# Altium project master-010106.PrjPcb (part 3 of 5)

## Sheet power.SchDoc
size A4; DocumentNumber: 5; SheetNumber: 5; SheetTotal: 24; SheetDescription: Decoupling and references for MCU0; ClassName: ISO_MCU
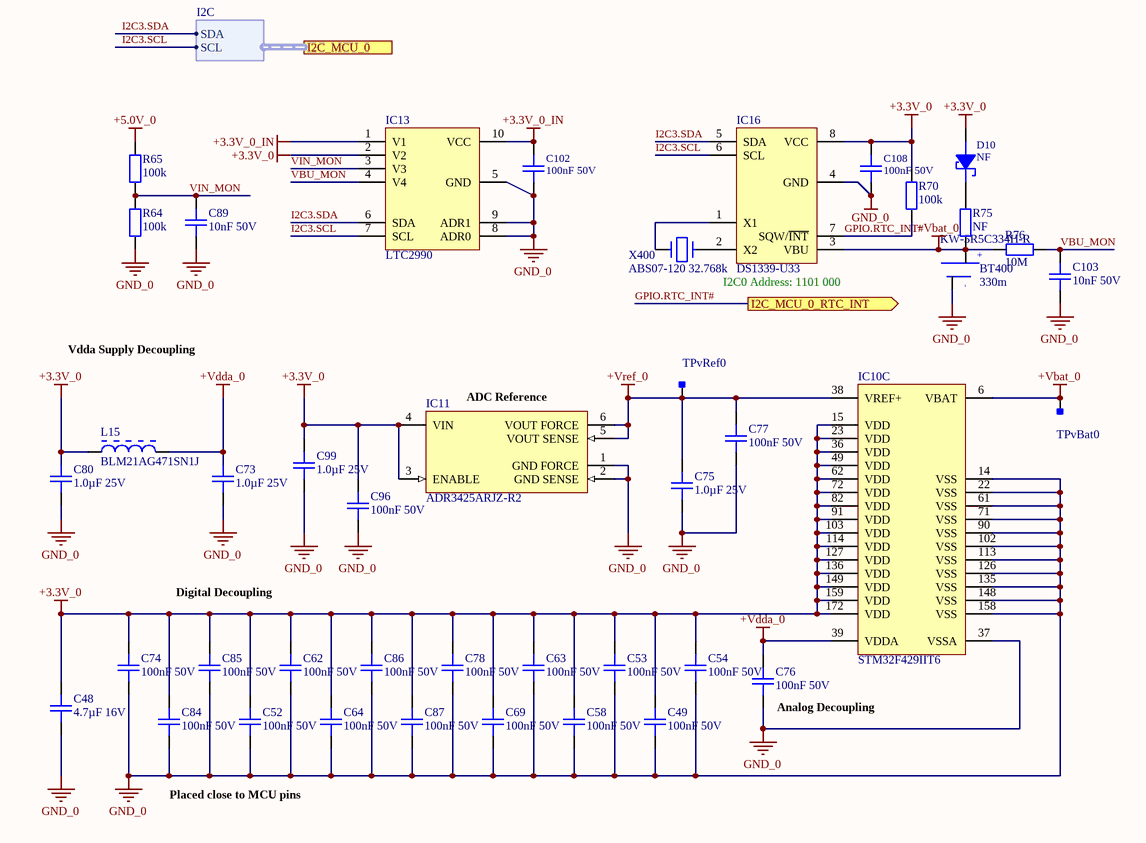
[diagram p12: power.SchDoc]

### Parts
(Parts that share a designator on the sheet are numbered #1, #2 ... from top to bottom, then left to right.)
BT400  330m  Supplier Part Number 1: KW-5R5C334H-R  [KW-5R5C]
C48  4.7µF 16V  [0805C]
C49  100nF 50V  [0402C]
C52  100nF 50V  [0402C]
C53  100nF 50V  [0402C]
C54  100nF 50V  [0402C]
C58  100nF 50V  [0402C]
C62  100nF 50V  [0402C]
C63  100nF 50V  [0402C]
C64#2  100nF 50V  [0402C]
C69  100nF 50V  [0402C]
C73  1.0µF 25V  [0603C]
C74#2  100nF 50V  [0402C]
C75  1.0µF 25V  [0603C]
C76  100nF 50V  [0402C]
C77  100nF 50V  [0402C]
C78#1  100nF 50V  [0402C]
C80  1.0µF 25V  [0603C]
C84#1  100nF 50V  [0402C]
C85  100nF 50V  [0402C]
C86  100nF 50V  [0402C]
C87  100nF 50V  [0402C]
C89  10nF 50V  [0603C]
C96  100nF 50V  [0603C]
C99#2  1.0µF 25V  [0603C]
C102#2  100nF 50V  [0603C]
C103  10nF 50V  [0603C]
C108  100nF 50V  [0603C]
D10  NF  [NF_SOD-523]
IC10  STM32F429IIT6  [STM-LQFP176_N]  (part C of 3)
IC11  ADR3425ARJZ-R2  [ADI-RJ-6_N]
IC13  LTC2990  [MSOP-10]
IC16  DS1339-U33  [USOP-8]
L15  BLM21AG471SN1J  [MURA-BLM21-H1-CHIP-2_V]
R64#2  100k  [0603R]
R65#2  100k  [0603R]
R70  100k  [0603R]
R75  NF  [0603R]
R76  10M  [0603R]
TPvBat0  Testpoint_Square  [Testpoint_S1]  (value not drawn)  (no BOM)
TPvRef0  Testpoint_Square  [Testpoint_S1]  (value not drawn)  (no BOM)
X400  ABS07-120 32.768k  [ABS07]

### Ports
I2C_MCU_0 (harness I2C), I2C_MCU_0_RTC_INT (out)

### Harnesses
I2C: SDA, SCL

### Nets
+3.3V_0: C48.1 C49.1 C52.1 C53.1 C54.1 C58.1 C62.1 C63.1 C64#2.1 C69.1 C74#2.1 C78#1.1 C80.1 C84#1.1 C85.1 C86.1 C87.1 C96.1 C99#2.1 C108.1 D10.1(A) IC10.15(VDD) IC10.23(VDD) IC10.36(VDD) IC10.49(VDD) IC10.62(VDD) IC10.72(VDD) IC10.82(VDD) IC10.91(VDD) IC10.103(VDD) IC10.114(VDD) IC10.127(VDD) IC10.136(VDD) IC10.149(VDD) IC10.159(VDD) IC10.172(VDD) IC11.3(ENABLE) IC11.4(VIN) IC13.2(V2) IC16.8(VCC) L15.1 R70.2
+3.3V_0_IN: C102#2.1 IC13.1(V1) IC13.10(VCC)
+5.0V_0: R65#2.2
+Vbat_0: BT400.1(pos1) IC10.6(VBAT) IC16.3(VBU) R75.2 R76.2 TPvBat0.1
+Vdda_0: C73.1 C76.1 IC10.39(VDDA) L15.2
+Vref_0: C75.1 C77.1 IC10.38(VREF+) IC11.5(VOUT_SENSE) IC11.6(VOUT_FORCE) TPvRef0.1
GND_0: BT400.2(neg) C48.2 C49.2 C52.2 C53.2 C54.2 C58.2 C62.2 C63.2 C64#2.2 C69.2 C73.2 C74#2.2 C75.2 C76.2 C77.2 C78#1.2 C80.2 C84#1.2 C85.2 C86.2 C87.2 C89.1 C96.2 C99#2.2 C102#2.2 C103.1 C108.2 IC10.14(VSS) IC10.22(VSS) IC10.37(VSSA) IC10.61(VSS) IC10.71(VSS) IC10.90(VSS) IC10.102(VSS) IC10.113(VSS) IC10.126(VSS) IC10.135(VSS) IC10.148(VSS) IC10.158(VSS) IC11.1(GND_FORCE) IC11.2(GND_SENSE) IC13.5(GND) IC13.8(ADR0) IC13.9(ADR1) IC16.4(GND) R64#2.1  [project net GND]
GPIO.RTC_INT#: IC16.7(SQW/~{INT}) R70.1 ; port I2C_MCU_0_RTC_INT
I2C3.SCL: IC13.7(SCL) IC16.6(SCL) ; port I2C_MCU_0.SCL
I2C3.SDA: IC13.6(SDA) IC16.5(SDA) ; port I2C_MCU_0.SDA
VBU_MON: C103.2 IC13.4(V4) R76.1
VIN_MON: C89.2 IC13.3(V3) R64#2.2 R65#2.1
NetD10_2: D10.2(C) R75.1
NetIC16_1: IC16.1(X1) X400.2
NetIC16_2: IC16.2(X2) X400.1

### Notes on the sheet
- I2C0 Address: 1101 000
- Vdda Supply Decoupling
- (near IC11) ADC Reference
- Digital Decoupling
- (near C76) Analog Decoupling
- Placed close to MCU pins
- Title
- Size:
- Date:
- Tabloid
- Number:
- Time:
- Revision:
- Sheet
- of
- File:
- (in symbol BATTERY_1) +; -

### Library data of the parts
BT400 = BATTERY_1: Eaton 330mF, 5.5v, -20 to +80, Ultracapacitor, KW-5R5C334H-R; Manufacturer 1: Eaton - Electronics Division; DBDesc: 330m 5.5V super capacitor -40-+85degC 13.5mm 8.5mm tall, RoHS compliant (DUPLICATE OF ID#22645); ID: 27713; Capacitance: 330mF; Manufacturer Part Number 1: KW-5R5C334H-R; Supplier 1: Avnet; Stock 1: 0; Pricing 1: 400=2.49000, 800=2.39000, 1600=2.29000, 2400=2.29000, 4000=2.19000 (USD); RoHS: No
C48 = gen_C_ceramic_4u7_16V_X7R_0805: Ceramic, 4.7µF, ±10%, 16V, X7R, –55 to 125°C, 0805 (2012),RoHS, Automotive; Part Number: GCJ21BR71C475KA01; Manufacturer: Murata; Capacitance: 4u7; Case EIA: 0805; Case Metric: 2012; AVT Set: x; Automotive Qualified: True; PnP Package: C_0805_10; PnP Value: 4.7µF/16V/X7R; Rated Voltage: 16V; Dielectric: X7R; Supplier 1: Digi-Key; Supplier Part Number 1: 490-10557-1-ND; Height - Seated (Max): 1.25mm; Mounting Type: SurfaceMount,MLCC; Operating Temperature: –55 to 125°C; Series: GCJ; Tolerance: ±10%; Manufacturer_Part_Number: GCJ21BR71C475KA01
C49 C52-C54 C58 C62 C63 C64#2 C69 C74#2 C76 C77 C78#1 C84#1 C85-C87 = gen_C_ceramic_100n_50V_X7R_0402: Ceramic, 100nF, ±10%, 50V, X7R, –55 to 125°C, 0402 (1005),RoHS, Automotive; Part Number: GCM155R71H104KE02; Manufacturer: Murata; Capacitance: 100n; Case EIA: 0402; Case Metric: 1005; PnP Package: C_0402_10; PnP Value: 100nF/50V/X7R; Automotive Qualified: True; PnP equipped: x; Rated Voltage: 50V; Dielectric: X7R; Supplier 1: Digi-Key; Supplier Part Number 1: 490-10672-1-ND; Height - Seated (Max): 0.5mm; Mounting Type: SurfaceMount,MLCC; Operating Temperature: –55 to 125°C; Series: GCM; Tolerance: ±10%; Manufacturer_Part_Number: GCM155R71H104KE02
C73 C75 C80 C99#2 = gen_C_ceramic_1u_25V_X7R_0603: Ceramic, 1.0µF, ±10%, 25V, X7R, –55 to 125°C, 0603 (1608),RoHS, Automotive; Part Number: GCJ188R71E105KA01; Manufacturer: Murata; Capacitance: 1µF; Case EIA: 0603; Case Metric: 1608; PnP Package: C_0603_10; PnP Value: 1.0µF/25V/X7R; Automotive Qualified: True; Rated Voltage: 25V; Dielectric: X7R; Supplier 1: Digi-Key; Supplier Part Number 1: 490-14409-1-ND; Height - Seated (Max): 0.8mm; Mounting Type: SurfaceMount,MLCC; Operating Temperature: –55 to 125°C; Series: GCJ; Tolerance: ±10%; Manufacturer_Part_Number: GCJ188R71E105KA01
C89 C103 = gen_C_ceramic_10n_50V_X7R_0603: Ceramic, 10nF, ±10%, 50V, X7R, –55 to 125°C, 0603 (1608),RoHS, Automotive; Part Number: GCJ188R71H102KA01; Manufacturer: Murata; Case EIA: 0603; Case Metric: 1608; Capacitance: 10n; Automotive Qualified: True; PnP Package: C_0603_10; PnP Value: 10nF/50V/X7R; Dielectric: X7R; Rated Voltage: 50V; Height - Seated (Max): 0.8mm; Mounting Type: SurfaceMount,MLCC; Operating Temperature: –55 to 125°C; Series: GCJ; Tolerance: ±10%; Manufacturer_Part_Number: GCJ188R71H102KA01; Supplier 1: Digi-Key; Supplier Part Number 1: 490-5768-1-ND
C96 = gen_C_ceramic_100n_50V_X7R_0603: Ceramic, 100nF, ±10%, 50V, X7R, –55 to 125°C, 0603 (1608),RoHS, Automotive; Part Number: GCJ188R71H104KA12; Manufacturer: Murata; Capacitance: 100n; Case EIA: 0603; Case Metric: 1608; PnP Package: C_0603_10; PnP Value: 100nF/50V/X7R; PnP equipped: x; Automotive Qualified: True; Rated Voltage: 50V; Dielectric: X7R; Supplier 1: Digi-Key; Supplier Part Number 1: 490-5798-1-ND; Height - Seated (Max): 0.8mm; Mounting Type: SurfaceMount,MLCC; Operating Temperature: –55 to 125°C; Series: GCJ; Tolerance: ±10%; Manufacturer_Part_Number: GCJ188R71H104KA12
C102#2 C108 = gen_C_ceramic_100n_50V_X7R_0603: Ceramic, 100nF, ±10%, 50V, X7R, –55 to 125°C, 0603 (1608),RoHS, Automotive; Part Number: GCJ188R71H104KA12; Manufacturer: Murata; Capacitance: 100n; Case EIA: 0603; Case Metric: 1608; Automotive Qualified: True; PnP Package: C_0603_10; PnP Value: 100nF/50V/X7R; Dielectric: X7R; Rated Voltage: 50V; Height - Seated (Max): 0.8mm; Mounting Type: SurfaceMount,MLCC; Operating Temperature: –55 to 125°C; Series: GCJ; Tolerance: ±10%; Manufacturer_Part_Number: GCJ188R71H104KA12; Supplier 1: Digi-Key; Supplier Part Number 1: 490-5798-1-ND
D10 = DIODE_SCHTKY: '''BAT41 Schottky diode, small signal''' / - If(avg) = 200mA, Vf(max) = 1V@200mA / - Vr(max) = 100V, Ir = 100nA@50V, 25deg / - SOD-523 package, RoHS compliant; DBDesc: do not populate, RoHS compliant; ID: 908; Preffered ID: 20995
IC10 = MC-ARM-STM32F4X9-SQ176: ARM Cortex-M4 32-bit MCU+FPU, 225 DMIPS, 2048 kB Flash, 256 kB Internal RAM, 140 I/Os, 176-pin LQFP, -40 to 85 degC, Tray; Manufacturer: STMicroelectronics; Internal RAM Size (kB): 256; I/Os (High Current): 140; FLASH Size (Prog) (kB): 2048; D/A Converter: 2x12-bit; Supply Voltage(Vcc) max (V): 3.6; Operating Frequency(F) (Processor speed) (MHz): 180; Supply Voltage(Vcc) min (V): 1.8; Core: ARM Cortex-M4; PackageReference: LQFP176; ComponentLink1Description: Manufacturer URL; Packing: Tray; ComponentLink2Description: Datasheet; ComponentLink3Description: Package Specification; ComponentLink2URL: http://www.st.com/st-web-ui/static/active/en/resource/technical/document/data_brief/DM00053488.pdf; PackageVersion: Rev. 4, 06/2013; ComponentLink1URL: http://www.st.com/web/en/home.html; DatasheetVersion: Rev. 2; PartNumber: STM32F429IIT6; PackageDescription: 176-Pin Low Profile Quad Flat Package, 24 x 24 mm Body, 0.5 mm Pitch; ComponentLink3URL: http://www.st.com/st-web-ui/static/active/en/resource/technical/document/datasheet/DM00035129.pdf; Mounting Technology: Surface Mount; Part Number: STM32F429IIT6
IC11 = CMP-0784-00366-1: Micropower, High Accuracy Voltage Reference, 2.5 V Output, 2.7 to 5.5 V Supply, Industrial, 6-pin SOT23 (RJ-6), Reel; Manufacturer: Analog Devices; Vout: 2.5V; Ref Out TC (ppm/C): 2.5; Min V Supply (V): 2.7; Max V Supply (V): 5.5; ComponentLink3URL: http://www.analog.com/static/imported-files/packages/PKG_PDF/SOT-23(RJ)/RJ_6.pdf; Mounting Technology: Surface Mount; Packing: Reel; ComponentLink3Description: Package Specification; Code_JEDEC: MO-178-AB; PackageReference: RJ-6; Operating Temp Range: -40 to 125 degC; PartNumber: ADR3425ARJZ-R2; ComponentLink2Description: Datasheet; PackageDescription: 6-Pin Small Outline Transistor Package, Body 2.9 x 1.6 mm, Pitch 0.95 mm; ComponentLink1URL: http://www.analog.com/en/index.html; ComponentLink2URL: http://www.analog.com/static/imported-files/data_sheets/ADR3412_ADR3420_ADR3425_ADR3430_ADR3433_ADR3440_ADR3450.pdf; ComponentLink1Description: Manufacturer URL; PackageVersion: 121608-A, 12/2008; ComponentLink4URL: Product URL:http://www.analog.com/en/special-linear-functions/voltage-references/adr3425/products/product.html; ComponentLink4Description: URL Link1; DatasheetVersion: Rev. B; Part Number: ADR3425ARJZ-R2
IC13 = LTC2990: ID: 19355; DBDesc: Linear LTC2990IMS quad I2C voltage, current and temperature monitor, -40°C to +85°C, 10-pin MSOP, RoHS compliant; Part Number: LTC2990
IC16 = DS1339-U33: DBDesc: DS1339U-33+ RTC I2C w/alarm USOP-8, RoHS compliant; ID: 11376; Part Number: DS1339-U33
L15 = CMP-0686-00649-2: Chip Ferrite Bead for General Signal lines, 470 Ohm, 700 mA, -55 to 125 degC, 2 x 1.25 x 1.05 mm SMD, Tape and Reel; Manufacturer: Murata; DC Resistance: 0.19 Ohm Max.; Impedance (at 100 MHz): 470 Ohm +/- 25%; Rated Current: 700 mA; ComponentLink1URL: http://www.murata.com/; Packing: Tape and Reel; PackageDescription: 2-Pin Chip, Body 2 x 1.25 mm; ComponentLink3Description: Package Specification; Operating Temperature Range: -55 to 125 degC; ComponentLink1Description: Manufacturer URL; PartNumber: BLM21AG471SN1J; DatasheetVersion: 08/2013; Mounting Technology: Surface Mount; ComponentLink2URL: http://www.murata.com/products/catalog/pdf/c31e.pdf; ComponentLink3URL: http://www.murata.com/products/catalog/pdf/c31e.pdf; ComponentLink2Description: Datasheet; PackageReference: BLM21_H1050-2; Part Number: BLM21AG471SN1J
R64#2 R65#2 R70 = gen_R_100k_0603: SMD Resistor 100k 0603; Case EIA: 0603; Case Metric: 1608; PnP Package: R_0603; Automotive Qualified: False; Operating Temperature: -55°C - +155°C; PnP Value: 100k; Part Number: gen_R_100k_0603
R75 = gen_R_NF_0603: SMD Resistor NF 0603; Case EIA: 0603; Case Metric: 1608; PnP Package: R_0603; Automotive Qualified: False; Operating Temperature: -55°C - +155°C; Part Number: gen_R_NF_0603; PnP Value: NF
R76 = gen_R_10M_0603: SMD Resistor 10M 0603; Part Number: gen_R_10Meg_0603; Case EIA: 0603; Case Metric: 1608; PnP Package: R_0603; PnP Value: 10Meg; Automotive Qualified: False; Operating Temperature: -55°C - +155°C
TPvBat0 TPvRef0 = Testpoint_Square: Testpoint, square; Part Number: Testpoint_Square
X400 = CRYSTAL1: ID: 22914; DBDesc: 32.768kHz ABS07-120, 20ppm, 6pF load, 60k ESR, 3.2x1.5mm crystal, RoHS compliant

## Sheet SDRAM.SchDoc: foxBMS BMS-Master
size A3; DocumentNumber: 22; SheetNumber: 22; SheetTotal: 24; Author: Fraunhofer IISB foxBMS Team; REL-DATE: 2017-05-16; VERSION: 1.0.2; SheetDescription: 8MB SDRAM
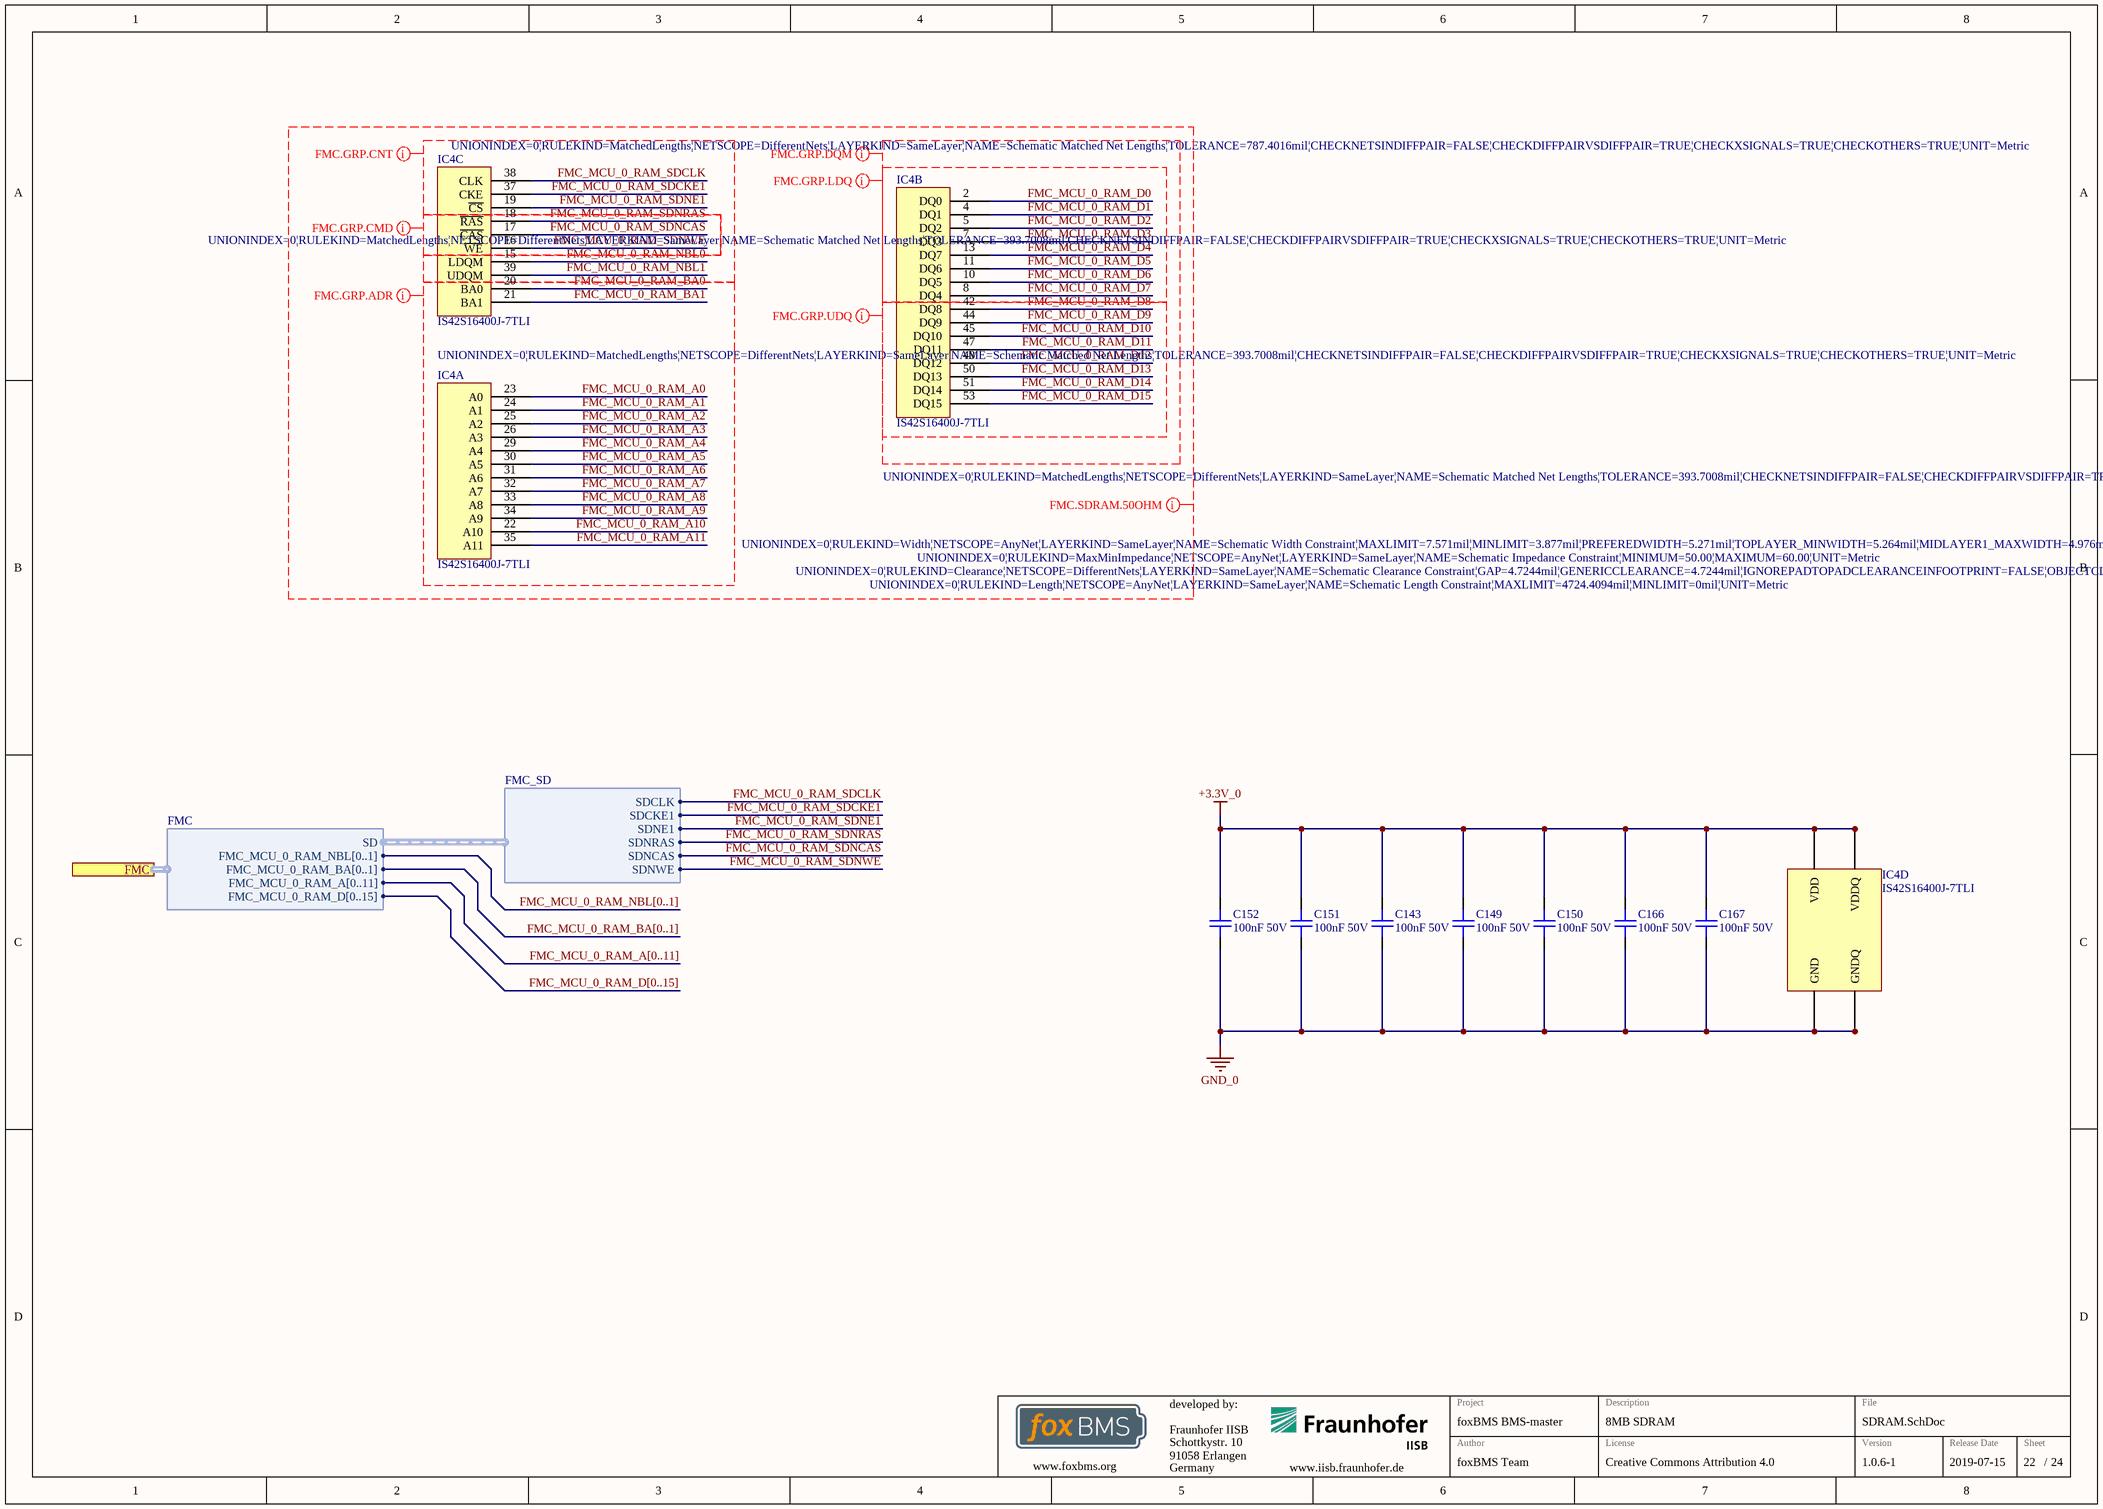
[diagram p13: SDRAM.SchDoc]

### Parts
C143  100nF 50V  [0603C]
C149  100nF 50V  [0603C]
C150  100nF 50V  [0603C]
C151  100nF 50V  [0603C]
C152  100nF 50V  [0603C]
C166  100nF 50V  [0603C]
C167  100nF 50V  [0603C]
IC4  IS42S16400J-7TLI  [TSOP80P1180X120-54N]  (parts A,B,C,D of 4)

### Ports
FMC (harness FMC)

### Harnesses
FMC_SD: SDCLK, SDCKE1, SDNE1, SDNRAS, SDNWE, SDNCAS
FMC: SD, FMC_MCU_0_RAM_NBL[0..1], FMC_MCU_0_RAM_BA[0..1], FMC_MCU_0_RAM_A[0..11], FMC_MCU_0_RAM_D[0..15]

### Nets
+3.3V_0: C143.1 C149.1 C150.1 C151.1 C152.1 C166.1 C167.1 IC4.1(VDD) IC4.3(VDDQ) IC4.9(VDDQ) IC4.14(VDD) IC4.27(VDD) IC4.43(VDDQ) IC4.49(VDDQ)
GND_0: C143.2 C149.2 C150.2 C151.2 C152.2 C166.2 C167.2 IC4.6(GNDQ) IC4.12(GNDQ) IC4.28(GND) IC4.41(GND) IC4.46(GNDQ) IC4.52(GNDQ) IC4.54(GND)  [project net GND]
FMC_MCU_0_RAM_A0: IC4.23(A0)
FMC_MCU_0_RAM_A1: IC4.24(A1)
FMC_MCU_0_RAM_A2: IC4.25(A2)
FMC_MCU_0_RAM_A3: IC4.26(A3)
FMC_MCU_0_RAM_A4: IC4.29(A4)
FMC_MCU_0_RAM_A5: IC4.30(A5)
FMC_MCU_0_RAM_A6: IC4.31(A6)
FMC_MCU_0_RAM_A7: IC4.32(A7)
FMC_MCU_0_RAM_A8: IC4.33(A8)
FMC_MCU_0_RAM_A9: IC4.34(A9)
FMC_MCU_0_RAM_A10: IC4.22(A10)
FMC_MCU_0_RAM_A11: IC4.35(A11)
FMC_MCU_0_RAM_BA0: IC4.20(BA0)
FMC_MCU_0_RAM_BA1: IC4.21(BA1)
FMC_MCU_0_RAM_D0: IC4.2(DQ0)
FMC_MCU_0_RAM_D1: IC4.4(DQ1)
FMC_MCU_0_RAM_D2: IC4.5(DQ2)
FMC_MCU_0_RAM_D3: IC4.7(DQ3)
FMC_MCU_0_RAM_D4: IC4.13(DQ7)
FMC_MCU_0_RAM_D5: IC4.11(DQ6)
FMC_MCU_0_RAM_D6: IC4.10(DQ5)
FMC_MCU_0_RAM_D7: IC4.8(DQ4)
FMC_MCU_0_RAM_D8: IC4.42(DQ8)
FMC_MCU_0_RAM_D9: IC4.44(DQ9)
FMC_MCU_0_RAM_D10: IC4.45(DQ10)
FMC_MCU_0_RAM_D11: IC4.47(DQ11)
FMC_MCU_0_RAM_D12: IC4.48(DQ12)
FMC_MCU_0_RAM_D13: IC4.50(DQ13)
FMC_MCU_0_RAM_D14: IC4.51(DQ14)
FMC_MCU_0_RAM_D15: IC4.53(DQ15)
FMC_MCU_0_RAM_NBL0: IC4.15(LDQM)
FMC_MCU_0_RAM_NBL1: IC4.39(UDQM)
FMC_MCU_0_RAM_SDCKE1: IC4.37(CKE) ; harness FMC_SD.SDCKE1
FMC_MCU_0_RAM_SDCLK: IC4.38(CLK) ; harness FMC_SD.SDCLK
FMC_MCU_0_RAM_SDNCAS: IC4.17(~{CAS}) ; harness FMC_SD.SDNCAS
FMC_MCU_0_RAM_SDNE1: IC4.19(~{CS}) ; harness FMC_SD.SDNE1
FMC_MCU_0_RAM_SDNRAS: IC4.18(~{RAS}) ; harness FMC_SD.SDNRAS
FMC_MCU_0_RAM_SDNWE: IC4.16(~{WE}) ; harness FMC_SD.SDNWE

### Buses and harness runs
bus FMC_MCU_0_RAM_A[0..11]
bus FMC_MCU_0_RAM_BA[0..1]
bus FMC_MCU_0_RAM_D[0..15]
bus FMC_MCU_0_RAM_NBL[0..1]

### Layout directives
net class FMC.DQM; rule Matched Net Lengths [Tolerance = 10mm]: FMC_MCU_0_RAM_D0, FMC_MCU_0_RAM_D1, FMC_MCU_0_RAM_D2, FMC_MCU_0_RAM_D3, FMC_MCU_0_RAM_D4, FMC_MCU_0_RAM_D5, FMC_MCU_0_RAM_D6, FMC_MCU_0_RAM_D7, FMC_MCU_0_RAM_D8, FMC_MCU_0_RAM_D9, FMC_MCU_0_RAM_D10, FMC_MCU_0_RAM_D11, FMC_MCU_0_RAM_D12, FMC_MCU_0_RAM_D13, FMC_MCU_0_RAM_D14, FMC_MCU_0_RAM_D15
net class FMC.ADR; rule Matched Net Lengths [Tolerance = 10mm]: FMC_MCU_0_RAM_A0, FMC_MCU_0_RAM_A1, FMC_MCU_0_RAM_A2, FMC_MCU_0_RAM_A3, FMC_MCU_0_RAM_A4, FMC_MCU_0_RAM_A5, FMC_MCU_0_RAM_A6, FMC_MCU_0_RAM_A7, FMC_MCU_0_RAM_A8, FMC_MCU_0_RAM_A9, FMC_MCU_0_RAM_A10, FMC_MCU_0_RAM_A11, FMC_MCU_0_RAM_BA0, FMC_MCU_0_RAM_BA1
net class FMC.CMD; rule Matched Net Lengths [Tolerance = 10mm]: FMC_MCU_0_RAM_SDNCAS, FMC_MCU_0_RAM_SDNRAS, FMC_MCU_0_RAM_SDNWE
net class FMC.CNTRL; rule Matched Net Lengths [Tolerance = 20mm]: FMC_MCU_0_RAM_NBL0, FMC_MCU_0_RAM_NBL1, FMC_MCU_0_RAM_SDCKE1, FMC_MCU_0_RAM_SDCLK, FMC_MCU_0_RAM_SDNE1
net class FMC.LDQ: FMC_MCU_0_RAM_D0, FMC_MCU_0_RAM_D1, FMC_MCU_0_RAM_D2, FMC_MCU_0_RAM_D3, FMC_MCU_0_RAM_D4, FMC_MCU_0_RAM_D5, FMC_MCU_0_RAM_D6, FMC_MCU_0_RAM_D7, FMC_MCU_0_RAM_D8, FMC_MCU_0_RAM_D9, FMC_MCU_0_RAM_D10, FMC_MCU_0_RAM_D11, FMC_MCU_0_RAM_D12, FMC_MCU_0_RAM_D13, FMC_MCU_0_RAM_D14, FMC_MCU_0_RAM_D15
net class FMC.UDQ: FMC_MCU_0_RAM_D0, FMC_MCU_0_RAM_D1, FMC_MCU_0_RAM_D2, FMC_MCU_0_RAM_D3, FMC_MCU_0_RAM_D4, FMC_MCU_0_RAM_D5, FMC_MCU_0_RAM_D6, FMC_MCU_0_RAM_D7, FMC_MCU_0_RAM_D8, FMC_MCU_0_RAM_D9, FMC_MCU_0_RAM_D10, FMC_MCU_0_RAM_D11, FMC_MCU_0_RAM_D12, FMC_MCU_0_RAM_D13, FMC_MCU_0_RAM_D14, FMC_MCU_0_RAM_D15
rule Length Constraint [Min Length = 0mm    Max Length = 120mm]; net class FMC.SDRAM; rule Width Constraint [Pref Impedance = 50.00ohms    Min Impedance = 50.00ohms    Max Impedance = 50.00ohms]; rule Clearance Constraint [Generic clearance = 0.12mm, and 24 value(s) for objects]; rule Impedance Constraint [Min = 50.00    Max = 60.00    ]: FMC_MCU_0_RAM_A0, FMC_MCU_0_RAM_A1, FMC_MCU_0_RAM_A2, FMC_MCU_0_RAM_A3, FMC_MCU_0_RAM_A4, FMC_MCU_0_RAM_A5, FMC_MCU_0_RAM_A6, FMC_MCU_0_RAM_A7, FMC_MCU_0_RAM_A8, FMC_MCU_0_RAM_A9, FMC_MCU_0_RAM_A10, FMC_MCU_0_RAM_A11, FMC_MCU_0_RAM_BA0, FMC_MCU_0_RAM_BA1, FMC_MCU_0_RAM_D0, FMC_MCU_0_RAM_D1, FMC_MCU_0_RAM_D2, FMC_MCU_0_RAM_D3, FMC_MCU_0_RAM_D4, FMC_MCU_0_RAM_D5, FMC_MCU_0_RAM_D6, FMC_MCU_0_RAM_D7, FMC_MCU_0_RAM_D8, FMC_MCU_0_RAM_D9, FMC_MCU_0_RAM_D10, FMC_MCU_0_RAM_D11, FMC_MCU_0_RAM_D12, FMC_MCU_0_RAM_D13, FMC_MCU_0_RAM_D14, FMC_MCU_0_RAM_D15, FMC_MCU_0_RAM_NBL0, FMC_MCU_0_RAM_NBL1, FMC_MCU_0_RAM_SDCKE1, FMC_MCU_0_RAM_SDCLK, FMC_MCU_0_RAM_SDNCAS, FMC_MCU_0_RAM_SDNE1, FMC_MCU_0_RAM_SDNRAS, FMC_MCU_0_RAM_SDNWE

### Notes on the sheet
- Fraunhofer IISB
- Schottkystr. 10
- developed by:
- 91058 Erlangen
- Germany
- Author
- Project
- License
- Description
- File
- Version
- Release Date
- Sheet
- www.foxbms.org
- www.iisb.fraunhofer.de
- foxBMS Team
- /

### Library data of the parts
C143 C149-C152 C166 C167 = gen_C_ceramic_100n_50V_X7R_0603: as C96 on sheet power; Rated Voltage: 50V; Dielectric: X7R; Supplier 1: Digi-Key; Supplier Part Number 1: 490-5798-1-ND; Height - Seated (Max): 0.8mm; Mounting Type: SurfaceMount,MLCC; Operating Temperature: –55 to 125°C; Series: GCJ; Tolerance: ±10%; Manufacturer_Part_Number: GCJ188R71H104KA12
IC4 = IS42S16400J-7TLI: SDRAM, 4M x 16 Bit; Manufacturer: INTEGRATED SILICON SOLUTION (ISSI); PnP Package: TSOP II; Automotive Qualified: True; Part Number: IS42S16400J-7TLI; Part Name: IS42S16400J-7TLI; Operating Temperature: -40 / o / C to +85 / o / -40°C - +85°C; ComponentLink1Description: Datasheet; ComponentLink1URL: http://www.farnell.com/datasheets/1674895.pdf; Supplier 1: Farnell; Supplier Part Number 1: 2253831

## Sheet mcu0_to_mcu1_isolated_SPI.SchDoc: foxBMS BMS-Master
size A3; DocumentNumber: 12; SheetNumber: 12; SheetTotal: 24; Author: Fraunhofer IISB foxBMS Team; REL-DATE: 2017-05-16; VERSION: 1.0.2; SheetDescription: Isolated Bidirectional Interface MCU0/MCU1
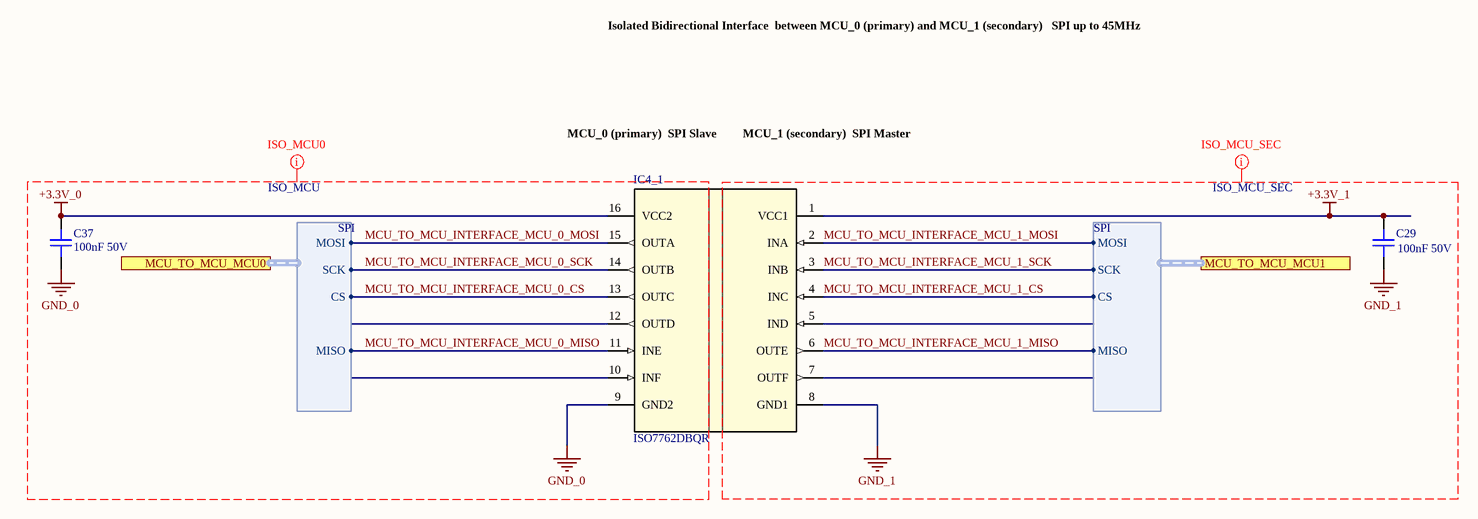
[diagram p14: mcu0_to_mcu1_isolated_SPI.SchDoc]

### Parts
C29  100nF 50V  [0603C]
C37  100nF 50V  [0603C]
IC4_1  ISO7762DBQR  [DBQ0016A_N]

### Ports
MCU_TO_MCU_MCU0 (harness SPI), MCU_TO_MCU_MCU1 (harness SPI)

### Harnesses
SPI: CS, MISO, MOSI, SCK

### Nets
+3.3V_0: C29.1 C37.2 IC4_1.1(VCC1) IC4_1.16(VCC2)  [also labelled +3.3V_1]
GND_0: C29.2 C37.1 IC4_1.8(GND1) IC4_1.9(GND2)  [also labelled GND_1]  [project net GND]
MCU_TO_MCU_INTERFACE_MCU_0_CS: IC4_1.13(OUTC) ; port MCU_TO_MCU_MCU0.CS
MCU_TO_MCU_INTERFACE_MCU_0_MISO: IC4_1.11(INE) ; port MCU_TO_MCU_MCU0.MISO
MCU_TO_MCU_INTERFACE_MCU_0_MOSI: IC4_1.15(OUTA) ; port MCU_TO_MCU_MCU0.MOSI
MCU_TO_MCU_INTERFACE_MCU_0_SCK: IC4_1.14(OUTB) ; port MCU_TO_MCU_MCU0.SCK
MCU_TO_MCU_INTERFACE_MCU_1_CS: IC4_1.4(INC) ; port MCU_TO_MCU_MCU1.CS
MCU_TO_MCU_INTERFACE_MCU_1_MISO: IC4_1.6(OUTE) ; port MCU_TO_MCU_MCU1.MISO
MCU_TO_MCU_INTERFACE_MCU_1_MOSI: IC4_1.2(INA) ; port MCU_TO_MCU_MCU1.MOSI
MCU_TO_MCU_INTERFACE_MCU_1_SCK: IC4_1.3(INB) ; port MCU_TO_MCU_MCU1.SCK

Not connected (* = marked no-connect by the designer): IC4_1 5(IND) 7(OUTF) 10(INF) 12(OUTD)

### Layout directives
net class ISO_MCU_SEC: +3.3V_1, GND_1, MCU_TO_MCU_INTERFACE_MCU_1_CS, MCU_TO_MCU_INTERFACE_MCU_1_MISO, MCU_TO_MCU_INTERFACE_MCU_1_MOSI, MCU_TO_MCU_INTERFACE_MCU_1_SCK
net class ISO_MCU: +3.3V_0, GND_0, MCU_TO_MCU_INTERFACE_MCU_0_CS, MCU_TO_MCU_INTERFACE_MCU_0_MISO, MCU_TO_MCU_INTERFACE_MCU_0_MOSI, MCU_TO_MCU_INTERFACE_MCU_0_SCK

### Notes on the sheet
- Isolated Bidirectional Interface
  between MCU_0 (primary) and MCU_1 (secondary)
  SPI up to 45MHz
- MCU_0 (primary)
  SPI Slave
- MCU_1 (secondary)
  SPI Master
- Fraunhofer IISB
- Schottkystr. 10
- developed by:
- 91058 Erlangen
- Germany
- Author
- Project
- License
- Description
- File
- Version
- Release Date
- Sheet
- www.foxbms.org
- www.iisb.fraunhofer.de
- foxBMS Team
- /

### Library data of the parts
C29 C37 = gen_C_ceramic_100n_50V_X7R_0603: as C96 on sheet power; Rated Voltage: 50V; Dielectric: X7R; Supplier 1: Digi-Key; Supplier Part Number 1: 490-5798-1-ND; Height - Seated (Max): 0.8mm; Mounting Type: SurfaceMount,MLCC; Operating Temperature: –55 to 125°C; Series: GCJ; Tolerance: ±10%; Manufacturer_Part_Number: GCJ188R71H104KA12
IC4_1 = ISO7762DBQR: Imported; Manufacturer: Texas Instruments; PartNumber: ISO7760DBQR; RefDes: RefDes; TYPE: TYPE; Value: Value

## Sheet mcu1_secondary.SchDoc: foxBMS BMS-Master
size A3; DocumentNumber: 11; SheetNumber: 11; SheetTotal: 24; Author: Fraunhofer IISB foxBMS Team; REL-DATE: 2017-05-16; VERSION: 1.0.2; SheetDescription: MCU1 (Secondary); ClassName: ISO_MCU_SEC
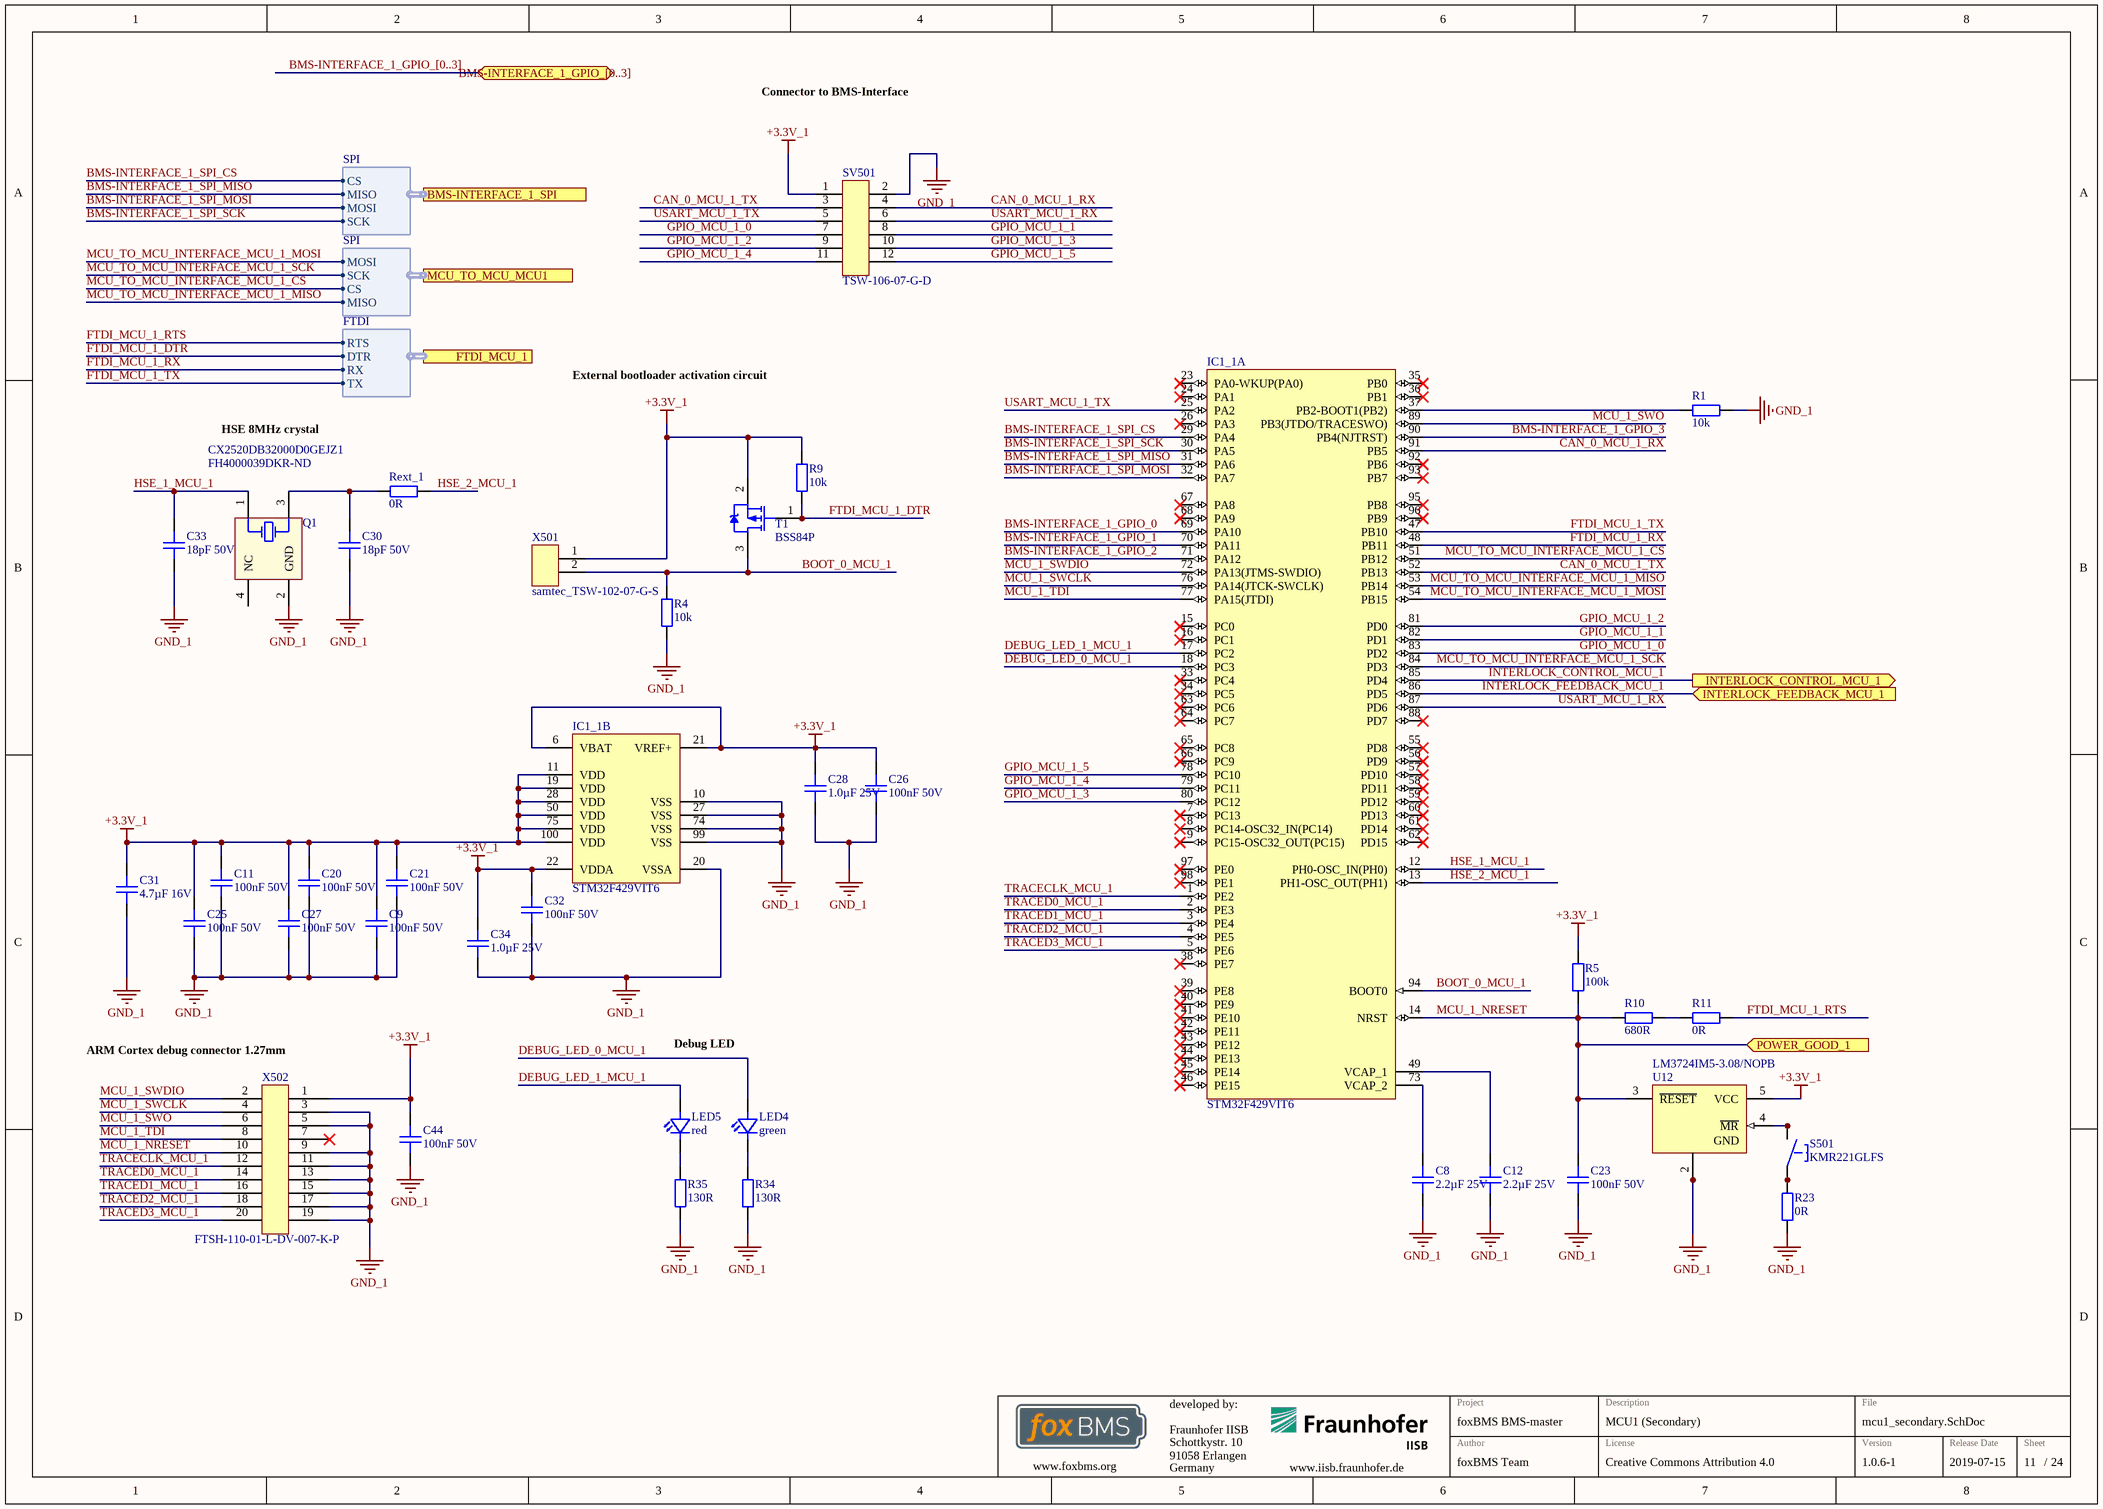
[diagram p15: mcu1_secondary.SchDoc]

### Parts
(Parts that share a designator on the sheet are numbered #1, #2 ... from top to bottom, then left to right.)
C8  2.2µF 25V  [0805C]
C9  100nF 50V  [0402C]
C11#1  100nF 50V  [0402C]
C12#1  2.2µF 25V  [0805C]
C20  100nF 50V  [0402C]
C21  100nF 50V  [0402C]
C23  100nF 50V  [0603C]
C25  100nF 50V  [0402C]
C26  100nF 50V  [0402C]
C27  100nF 50V  [0402C]
C28  1.0µF 25V  [0603C]
C30  18pF 50V  [0402C]
C31  4.7µF 16V  [0805C]
C32  100nF 50V  [0402C]
C33  18pF 50V  [0402C]
C34  1.0µF 25V  [0603C]
C44  100nF 50V  [0603C]
IC1_1  STM32F429VIT6  [STM-LQFP100_N]  (parts A,B of 2)
LED4  green  [LEDC1608X07N]
LED5  red  [LEDC1608X07N]
Q1  CX2520DB32000D0GEJZ1  Supplier Part Number 1: FH4000039DKR-ND  [AVX-CX2520DB32000D0GEJZ1-4_V]
R1#1  10k  [0603R]
R4#2  10k  [0603R]
R5#1  100k  [0603R]
R9  10k  [0603R]
R10  680R  [0603R]
R11  0R  [0603R]
R23  0R  [0603R]
R34  130R  [0603R]
R35#1  130R  [0603R]
Rext_1  0R  [0402R]
S501  KMR221GLFS  [KMR2_Series]
SV501  TSW-106-07-G-D  [Pinheader_2.54_2x6]
T1  BSS84P  [INF-PG-SOT23_N]
U12  LM3724IM5-3.08/NOPB  [MF05A_N]
X501  samtec_TSW-102-07-G-S  [Pinheader_2.54_2]
X502  FTSH-110-01-L-DV-007-K-P  [CORTEX_DEBUG_20_PIN]

### Ports
BMS-INTERFACE_1_GPIO_[0..3] (bidir), BMS-INTERFACE_1_SPI (harness SPI), FTDI_MCU_1 (harness FTDI), INTERLOCK_CONTROL_MCU_1 (out), INTERLOCK_FEEDBACK_MCU_1 (in), MCU_TO_MCU_MCU1 (harness SPI), POWER_GOOD_1 (in)

### Harnesses
SPI: CS, MISO, MOSI, SCK
FTDI: RTS, DTR, RX, TX

### Nets
+3.3V_1: C9.1 C11#1.1 C20.1 C21.1 C25.1 C26.1 C27.1 C28.1 C31.1 C32.1 C34.1 C44.1 IC1_1.6(VBAT) IC1_1.11(VDD) IC1_1.19(VDD) IC1_1.21(VREF+) IC1_1.22(VDDA) IC1_1.28(VDD) IC1_1.50(VDD) IC1_1.75(VDD) IC1_1.100(VDD) R5#1.2 R9.2 SV501.1 T1.2(SOURCE) U12.5(VCC) X501.1 X502.1  [project net +3.3V_0]
GND_1: C8.2 C9.2 C11#1.2 C12#1.2 C20.2 C21.2 C23.2 C25.2 C26.2 C27.2 C28.2 C30.2 C31.2 C32.2 C33.1 C34.2 C44.2 IC1_1.10(VSS) IC1_1.20(VSSA) IC1_1.27(VSS) IC1_1.74(VSS) IC1_1.99(VSS) Q1.2(GND) R1#1.1 R4#2.1 R23.1 R34.1 R35#1.1 SV501.2 U12.1(GND) U12.2(GND) X502.3 X502.5 X502.9 X502.11 X502.13 X502.15 X502.17 X502.19  [project net GND]
BMS-INTERFACE_1_GPIO_0: IC1_1.69(PA10)
BMS-INTERFACE_1_GPIO_1: IC1_1.70(PA11)
BMS-INTERFACE_1_GPIO_2: IC1_1.71(PA12)
BMS-INTERFACE_1_GPIO_3: IC1_1.90(PB4(NJTRST))
BMS-INTERFACE_1_SPI_CS: IC1_1.29(PA4) ; port BMS-INTERFACE_1_SPI.CS
BMS-INTERFACE_1_SPI_MISO: IC1_1.31(PA6) ; port BMS-INTERFACE_1_SPI.MISO
BMS-INTERFACE_1_SPI_MOSI: IC1_1.32(PA7) ; port BMS-INTERFACE_1_SPI.MOSI
BMS-INTERFACE_1_SPI_SCK: IC1_1.30(PA5) ; port BMS-INTERFACE_1_SPI.SCK
BOOT_0_MCU_1: IC1_1.94(BOOT0) R4#2.2 T1.3(DRAIN) X501.2
CAN_0_MCU_1_RX: IC1_1.91(PB5) SV501.4
CAN_0_MCU_1_TX: IC1_1.52(PB13) SV501.3
DEBUG_LED_0_MCU_1: IC1_1.18(PC3) LED4.2(A)
DEBUG_LED_1_MCU_1: IC1_1.17(PC2) LED5.2(A)
FTDI_MCU_1_DTR: R9.1 T1.1(GATE) ; port FTDI_MCU_1.DTR
FTDI_MCU_1_RTS: R11.2 ; port FTDI_MCU_1.RTS
FTDI_MCU_1_RX: IC1_1.48(PB11) ; port FTDI_MCU_1.RX
FTDI_MCU_1_TX: IC1_1.47(PB10) ; port FTDI_MCU_1.TX
GPIO_MCU_1_0: IC1_1.83(PD2) SV501.7
GPIO_MCU_1_1: IC1_1.82(PD1) SV501.8
GPIO_MCU_1_2: IC1_1.81(PD0) SV501.9
GPIO_MCU_1_3: IC1_1.80(PC12) SV501.10
GPIO_MCU_1_4: IC1_1.79(PC11) SV501.11
GPIO_MCU_1_5: IC1_1.78(PC10) SV501.12
HSE_1_MCU_1: C33.2 IC1_1.12(PH0-OSC_IN(PH0)) Q1.1(HOT)
HSE_2_MCU_1: IC1_1.13(PH1-OSC_OUT(PH1)) Rext_1.1
INTERLOCK_CONTROL_MCU_1: IC1_1.85(PD4) ; port INTERLOCK_CONTROL_MCU_1
INTERLOCK_FEEDBACK_MCU_1: IC1_1.86(PD5) ; port INTERLOCK_FEEDBACK_MCU_1
MCU_1_NRESET: C23.1 IC1_1.14(NRST) R5#1.1 R10.1 U12.3(~{RESET}) X502.10 ; port POWER_GOOD_1
MCU_1_SWCLK: IC1_1.76(PA14(JTCK-SWCLK)) X502.4
MCU_1_SWDIO: IC1_1.72(PA13(JTMS-SWDIO)) X502.2
MCU_1_SWO: IC1_1.89(PB3(JTDO/TRACESWO)) X502.6
MCU_1_TDI: IC1_1.77(PA15(JTDI)) X502.8
MCU_TO_MCU_INTERFACE_MCU_1_CS: IC1_1.51(PB12) ; port MCU_TO_MCU_MCU1.CS
MCU_TO_MCU_INTERFACE_MCU_1_MISO: IC1_1.53(PB14) ; port MCU_TO_MCU_MCU1.MISO
MCU_TO_MCU_INTERFACE_MCU_1_MOSI: IC1_1.54(PB15) ; port MCU_TO_MCU_MCU1.MOSI
MCU_TO_MCU_INTERFACE_MCU_1_SCK: IC1_1.84(PD3) ; port MCU_TO_MCU_MCU1.SCK
TRACECLK_MCU_1: IC1_1.1(PE2) X502.12
TRACED0_MCU_1: IC1_1.2(PE3) X502.14
TRACED1_MCU_1: IC1_1.3(PE4) X502.16
TRACED2_MCU_1: IC1_1.4(PE5) X502.18
TRACED3_MCU_1: IC1_1.5(PE6) X502.20
USART_MCU_1_RX: IC1_1.87(PD6) SV501.6
USART_MCU_1_TX: IC1_1.25(PA2) SV501.5
NetC8_1: C8.1 IC1_1.73(VCAP_2)
NetC12#1_1: C12#1.1 IC1_1.49(VCAP_1)
NetC30_1: C30.1 Q1.3(HOT) Rext_1.2
NetIC1_1_37: IC1_1.37(PB2-BOOT1(PB2)) R1#1.2
NetLED4_1: LED4.1(C) R34.2
NetLED5_1: LED5.1(C) R35#1.2
NetR10_2: R10.2 R11.1
NetR23_2: R23.2 S501.1 S501.2
NetS501_3: S501.3 S501.4 U12.4(~{MR})

Not connected (* = marked no-connect by the designer): IC1_1 7(PC13)* 8(PC14-OSC32_IN(PC14))* 9(PC15-OSC32_OUT(PC15))* 15(PC0)* 16(PC1)* 23(PA0-WKUP(PA0))* 24(PA1)* 26(PA3)* 33(PC4)* 34(PC5)* 35(PB0)* 36(PB1)* 38(PE7)* 39(PE8)* 40(PE9)* 41(PE10)* 42(PE11)* 43(PE12)* 44(PE13)* 45(PE14)* 46(PE15)* 55(PD8)* 56(PD9)* 57(PD10)* 58(PD11)* 59(PD12)* 60(PD13)* 61(PD14)* 62(PD15)* 63(PC6)* 64(PC7)* 65(PC8)* 66(PC9)* 67(PA8)* 68(PA9)* 88(PD7)* 92(PB6)* 93(PB7)* 95(PB8)* 96(PB9)* 97(PE0)* 98(PE1)*; Q1 4(NC); X502 7*

### Buses and harness runs
bus BMS-INTERFACE_1_GPIO_[0..3] = port BMS-INTERFACE_1_GPIO_[0..3]

### Notes on the sheet
- Connector to BMS-Interface
- External bootloader activation circuit
- HSE 8MHz crystal
- (near X502) ARM Cortex debug connector 1.27mm
- Debug LED
- Fraunhofer IISB
- Schottkystr. 10
- developed by:
- 91058 Erlangen
- Germany
- Author
- Project
- License
- Description
- File
- Version
- Release Date
- Sheet
- www.foxbms.org
- www.iisb.fraunhofer.de
- foxBMS Team
- /

### Library data of the parts
C8 C12#1 = gen_C_ceramic_2u2_50V_X7R_0805: Ceramic, 2.2µF, ±10%, 25V, X7R, –55 to 125°C, 0805 (2012),RoHS, Automotive; Part Number: GCJ21BR71E225KA01; Manufacturer: Murata; Capacitance: 2u2; Case EIA: 0805; Case Metric: 2012; Automotive Qualified: True; PnP Package: C_0805_10; PnP Value: 2.2µF/25V/X7R; Rated Voltage: 25V; Dielectric: X7R; Height - Seated (Max): 1.25mm; Mounting Type: SurfaceMount,MLCC; Operating Temperature: –55 to 125°C; Series: GCJ; Tolerance: ±10%; Manufacturer_Part_Number: GCJ21BR71E225KA01
C9 C11#1 C20 C21 C25-C27 = gen_C_ceramic_100n_50V_X7R_0402: as C49 on sheet power; Rated Voltage: 50V; Dielectric: X7R; Supplier 1: Digi-Key; Supplier Part Number 1: 490-10672-1-ND; Height - Seated (Max): 0.5mm; Mounting Type: SurfaceMount,MLCC; Operating Temperature: –55 to 125°C; Series: GCM; Tolerance: ±10%; Manufacturer_Part_Number: GCM155R71H104KE02
C23 C44 = gen_C_ceramic_100n_50V_X7R_0603: as C96 on sheet power; Rated Voltage: 50V; Dielectric: X7R; Supplier 1: Digi-Key; Supplier Part Number 1: 490-5798-1-ND; Height - Seated (Max): 0.8mm; Mounting Type: SurfaceMount,MLCC; Operating Temperature: –55 to 125°C; Series: GCJ; Tolerance: ±10%; Manufacturer_Part_Number: GCJ188R71H104KA12
C28 C34 = gen_C_ceramic_1u_25V_X7R_0603: as C73 on sheet power; Rated Voltage: 25V; Dielectric: X7R; Supplier 1: Digi-Key; Supplier Part Number 1: 490-14409-1-ND; Height - Seated (Max): 0.8mm; Mounting Type: SurfaceMount,MLCC; Operating Temperature: –55 to 125°C; Series: GCJ; Tolerance: ±10%; Manufacturer_Part_Number: GCJ188R71E105KA01
C30 C33 = gen_C_ceramic_18p_50V_C0G_0402: Ceramic, 18pF, ±5%, 50V, X7R, 25 to 125°C, 0402 (1005),RoHS, Automotive; Part Number: GCM1555C1H180JA16#; Manufacturer: Murata; Capacitance: 18p; Dielectric: C0G; Case EIA: 0402; Case Metric: 1005; Automotive Qualified: True; PnP Package: C_0402_10; PnP Value: 18pF/50V/X7R; Rated Voltage: 50V; Supplier 1: Digi-Key; Supplier Part Number 1: 490-12650-1-ND; Height - Seated (Max): 0.5mm; Mounting Type: SurfaceMount,MLCC; Operating Temperature: 25 to 125°C; Series: GCM; Tolerance: ±5%; Manufacturer_Part_Number: GCM1555C1H180JA16#
C31 = gen_C_ceramic_4u7_16V_X7R_0805: as C48 on sheet power; Rated Voltage: 16V; Dielectric: X7R; Supplier 1: Digi-Key; Supplier Part Number 1: 490-10557-1-ND; Height - Seated (Max): 1.25mm; Mounting Type: SurfaceMount,MLCC; Operating Temperature: –55 to 125°C; Series: GCJ; Tolerance: ±10%; Manufacturer_Part_Number: GCJ21BR71C475KA01
C32 = gen_C_ceramic_100n_50V_X7R_0402: Ceramic, 100nF, ±10%, 50V, X7R, –55 to 125°C, 0402 (1005),RoHS, Automotive; Part Number: GCM155R71H104KE02; Manufacturer: Murata; Capacitance: 100n; Case EIA: 0402; Case Metric: 1005; PnP Package: C_0402_10; PnP Value: 100nF/50V/X7R; PnP equipped: x; Automotive Qualified: True; Rated Voltage: 50V; Dielectric: X7R; Supplier 1: Digi-Key; Supplier Part Number 1: 490-10672-1-ND; Height - Seated (Max): 0.5mm; Mounting Type: SurfaceMount,MLCC; Operating Temperature: –55 to 125°C; Series: GCM; Tolerance: ±10%; Manufacturer_Part_Number: GCM155R71H104KE02
IC1_1 = CMP-0243-00030-2: ARM Cortex-M4 32-bit MCU+FPU, 225 DMIPS, 2048 kB Flash, 256 kB Internal RAM, 82 I/Os, 100-pin LQFP, -40 to 85 degC, Tray; Manufacturer: STMicroelectronics; FLASH Size (Prog) (kB): 2048; Supply Voltage(Vcc) min (V): 1.8; Operating Frequency(F) (Processor speed) (MHz): 180; Supply Voltage(Vcc) max (V): 3.6; D/A Converter: 2x12-bit; Internal RAM Size (kB): 256; I/Os (High Current): 82; Mounting Technology: Surface Mount; ComponentLink3URL: http://www.st.com/st-web-ui/static/active/en/resource/technical/document/data_brief/DM00071938.pdf; ComponentLink2URL: http://www.st.com/st-web-ui/static/active/en/resource/technical/document/data_brief/DM00053488.pdf; ComponentLink3Description: Package Specification; Packing: Tray; PackageDescription: 100-Pin Low Profile Quad Flat Package, 14 x 14 mm Body, 0.5 mm Pitch; PartNumber: STM32F429VIT6; ComponentLink2Description: Datasheet; ComponentLink1Description: Manufacturer URL; ComponentLink1URL: http://www.st.com/web/en/home.html; DatasheetVersion: Rev. 2; Core: ARM Cortex-M4; PackageReference: LQFP100; PackageVersion: Rev. 1, 06/2013; Part Number: STM32F429VIT6
LED4 = gen_LED_0603_green: LED; Breakdown Voltage: 5V; Continuous Forward Current: 20mA; Forward Voltage @ 20mA: 2.2V; Automotive Qualified: False; Case EIA: 0603; Case Metric: 1608; Part Number: gen_LED_0603_green; Color: green; PnP Package: LED_0603; Supplier 1: Farnell; Supplier Part Number 1: 2099223
LED5 = gen_LED_0603_red: LED; Breakdown Voltage: 5V; Continuous Forward Current: 20mA; Forward Voltage @ 20mA: 2V; Automotive Qualified: False; Case EIA: 0603; Case Metric: 1608; Part Number: gen_LED_0603_red; Color: red; PnP Package: LED_0603; Supplier 1: Farnell; Supplier Part Number 1: 2099221
Q1 = CMP-0449-00001-1: Crystal,CRYSTAL 40MHZ 15PF 85degC Surface Mount 2.5 x 2.0 mm; Manufacturer: Kyocera; Drive Level: 10uW (100uW max.); Motional Series Resistance: 50 ohm (max); Frequency Range: 32000 kHz; Load Capacitance: 8 pF; Packing: Tape and Reel; ComponentLink2URL: http://global.kyocera.com/prdct/electro/pdf/xtal/cx2520db_cs_e.pdf; ComponentLink1Description: Manufacturer URL; PackageDescription: 4-Pin Hand Drawnï¼ŒBody 2.5x2mm; ComponentLink1URL: http://global.kyocera.com/; ComponentLink3URL: http://global.kyocera.com/prdct/electro/pdf/xtal/cx2520db_cs_e.pdf; ComponentLink2Description: Datasheet; PackageReference: CX2520DB32000D0GEJZ1-4; Operating Temperature: -10 to 70 degC; PartNumber: CX2520DB32000D0GEJZ1; ComponentLink3Description: Package Specification; Mounting Technology: Surface Mount; Supplier 1: Digi-Key
R1#1 R4#2 R9 = gen_R_10k_0603: SMD Resistor 10k 0603; Tolerance: 1%; Power: 0.1W; Case EIA: 0603; Case Metric: 1608; Maximum Working Voltage: 75V; PnP Package: R_0603; Automotive Qualified: False; Part Number: gen_R_10k_0603; Operating Temperature: -55°C - +155°C; Resistance: 10k; Series: E24, E96; PnP Value: 10k; Supplier 1: Farnell; Supplier Part Number 1: 2073349
R5#1 = gen_R_100k_0603: as R64#2 on sheet power; Part Number: gen_R_100k_0603; Operating Temperature: -55°C - +155°C; PnP Value: 100k
R10 = gen_R_680R_0603: SMD Resistor 680R 0603; Tolerance: 1%; Power: 0.1W; Case EIA: 0603; Case Metric: 1608; Maximum Working Voltage: 75V; PnP Package: R_0603; Automotive Qualified: False; Part Number: gen_R_680R_0603; Operating Temperature: -55°C - +155°C; Resistance: 680R; Series: E24; PnP Value: 680R; Supplier 1: Farnell; Supplier Part Number 1: 2797303
R11 R23 = gen_R_0R_0603: SMD Resistor 0R 0603; Power: 0.1W; Case EIA: 0603; Case Metric: 1608; PnP Package: R_0603; Maximum Working Voltage: 75V; Automotive Qualified: False; Part Number: gen_R_0R_0603; Operating Temperature: -55°C - +155°C; Resistance: 0R; Series: Jumper; PnP Value: 0R; Supplier 1: Farnell; Supplier Part Number 1: 2073345
R34 R35#1 = gen_R_130R_0603: SMD Resistor 130R 0603; Tolerance: 1%; Power: 0.1W; Case EIA: 0603; Case Metric: 1608; Maximum Working Voltage: 75V; PnP Package: R_0603; Automotive Qualified: False; Part Number: gen_R_130R_0603; Operating Temperature: -55°C - +155°C; Resistance: 130R; Series: E24, E96; PnP Value: 130R; Supplier 1: Farnell; Supplier Part Number 1: 2379959
Rext_1 = gen_R_0R_0402: SMD Resistor 0R 0402; Case EIA: 0402; Case Metric: 1005; PnP Package: R_0402; Automotive Qualified: False; Part Number: gen_R_0R_0402; PnP Value: 0R; Operating Temperature: -55°C - +155°C
S501 = KMR221GLFS: Microminiature Tactile Switch; Manufacturer: CK Components; Automotive Qualified: False; Part Number: KMR221GLFS; Operating Temperature: -40°C - +85°C; ComponentLink1Description: Datasheet; ComponentLink1URL: http://www.farnell.com/datasheets/1685525.pdf; Supplier 1: Farnell; Supplier Part Number 1: 1201424; Supplier 2: Digikey; Supplier Part Number 2: 401-1426-1-ND; Supplier 3: Mouser; Supplier Part Number 3: 611-KMR211G-LFS
SV501 = samtec_TSW-106-07-G-D: Board-To-Board Connector, Vertical, 2.54 mm, 12 Contacts, Header, TSW Series, Through Hole, 2 Rows; Manufacturer: Samtec; Circuits: 12; Rated Voltage: 500V AC mated with SSW; Automotive Qualified: False; Part Number: TSW-106-07-G-D; Part Name: TSW-106-07-G-D; Operating Temperature: -55°C - +125°C; ComponentLink1Description: Datasheet; ComponentLink1URL: http://www.farnell.com/datasheets/1992055.pdf?_ga=2.196729640.569325269.1503285096-1413671594.1503025027; Supplier 1: Farnell; Supplier Part Number 1: 2025252
T1 = CMP-1099-00028-1: P-Channel SIPMOS Small-Signal-Transistor, -60 V VDS, -0.17 A ID, -55 to 150 degC, PG-SOT23, Reel, Green; Manufacturer: Infineon; VGS(th) (max): -2Â V; VGS(th) (min): -1Â V; VDS (max): -60Â V; Rth: 350Â K/W; Pto t (max): 0.36Â W; ID (max): -0.17Â A; IDpuls (max): -0.68Â A; RDS (on) (max) (@4.5V): 12,000Â mOhm; QG: 1Â nC; Green: TRUE; RDS (on) (max): 8,000Â mOhm; ComponentLink3URL: http://www.infineon.com/dgdl/SOT23-Package_Overview.pdf?folderId=db3a30431936bc4b0119532290053c66&fileId=db3a30431936bc4b0119533468123c85; ComponentLink3Description: Package Specification; Packing: Reel; PartNumber: BSS84P; ComponentLink2Description: Datasheet; Mounting Technology: Surface Mount; ComponentLink2URL: http://www.infineon.com/dgdl/BSS84P_Rev2.7%5B1%5D.pdf?folderId=db3a304314dca38901154a72e3951a65&fileId=db3a304330f68606013118ac7a9b4549; PackageReference: PG-SOT23; ComponentLink1URL: http://www.infineon.com/; PackageVersion: Apr-08; ComponentLink1Description: Manufacturer URL; PackageDescription: 3-Pin Small Outline Transistor Package, 2.9 x 1.3 mm Body, 0.95 mm Pitch; Halogen-free: TRUE; DatasheetVersion: Rev. 2.7; Part Number: BSS84P
U12 = CMP-0063-01088-2: 5-Pin Microprocessor Reset Circuits, 5-pin SOT-23, Pb-Free; Manufacturer: National Semiconductor; PowerWise: N; PackageTopMarking: R53B*XTT; CompType: MiscPower; PackageVersion: revD, Aug-2008; ComponentLink3URL: http://www.national.com/packaging/folders/mf05a.html; ComponentLink2URL: http://www.national.com/pf/LM/LM3724.html; PinCount: 5; ComponentLink2Description: LM3724 Web Page; PackageDescription: Molded SOT-23, .115 x .063 x .040 in Body, 5 Lead, .0375 in Pitch; ComponentLink3Description: MF05A Package Page; ComponentLink1Description: LM3724 Datasheet; RevisionNote: Component URLs added; RoHS: Y; ComponentLink1URL: http://www.national.com/ds/LM/LM3724.pdf; DatasheetVersion: Jul-2007; PackageReference: MF05A
X501 = samtec_TSW-102-07-G-S: Board-To-Board Connector, Vertical, 2.54 mm, 2 Contacts, Header, TSW Series, Through Hole, 1 Row; Manufacturer: Samtec; Circuits: 2; Automotive Qualified: False; Part Number: samtec_TSW-102-07-G-S; Part Name: TSW-102-07-G-S; Operating Temperature: -55°C - +125°C; ComponentLink1Description: Datasheet; ComponentLink1URL: http://www.farnell.com/datasheets/1796313.pdf; Supplier 1: Farnell; Supplier Part Number 1: 2505044
X502 = samtec_FTSH-110-01-L-DV-007-K-P: Board-To-Board Connector, ARM Cortex Debug Header 20 Pin; Manufacturer: Samtec; Circuits: 20; Automotive Qualified: False; Part Number: samtec_FTSH-110-01-L-DV-007-K-P; Part Name: FTSH-110-01-L-DV-007-K-P; Operating Temperature: -55°C - +125°C; Supplier 1: Digikey; Supplier Part Number 1: SAM11268-ND; Supplier 2: Avnet; Supplier Part Number 2: FTSH-110-01-L-DV-007-K-P

## Sheet connector_to_BMS_extension.SchDoc: foxBMS BMS-Master
size A3; DocumentNumber: 24; SheetNumber: 24; SheetTotal: 24; Author: Fraunhofer IISB foxBMS Team; REL-DATE: 2017-05-16; VERSION: 1.0.2; SheetDescription: Connectors to BMS-Extension
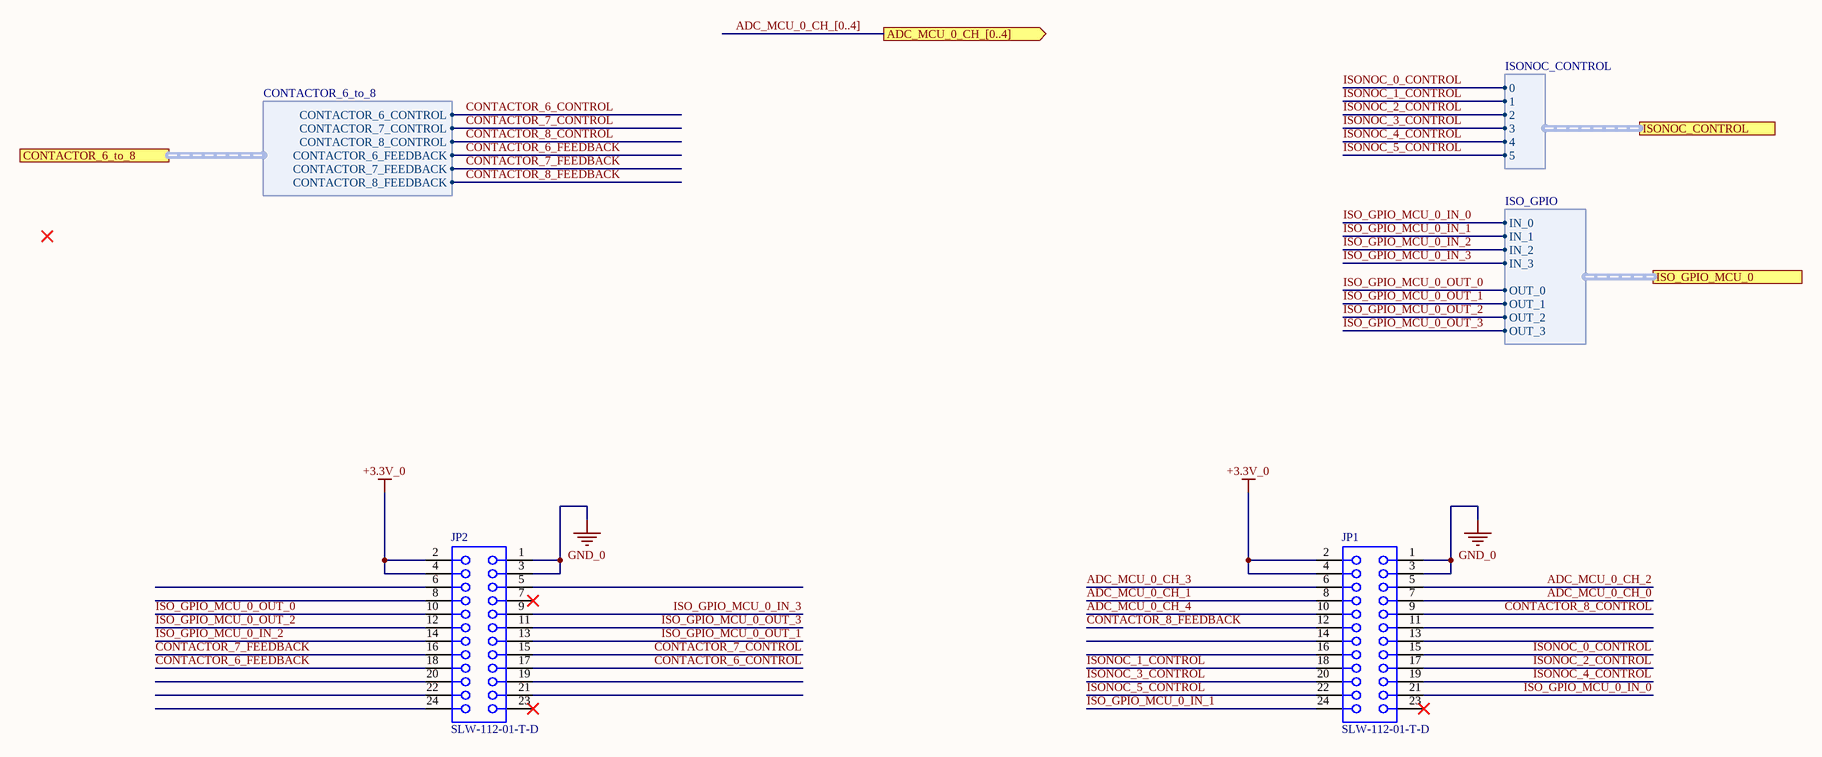
[diagram p16: connector_to_BMS_extension.SchDoc]

### Parts
JP1  SLW-112-01-T-D  [SMTC-SLW-112-01-X-D]
JP2  SLW-112-01-T-D  [SMTC-SLW-112-01-X-D]

### Ports
ADC_MCU_0_CH_[0..4] (out), CONTACTOR_6_to_8 (harness CONTACTOR_6_to_8), ISO_GPIO_MCU_0 (harness ISO_GPIO), ISONOC_CONTROL (harness ISONOC_CONTROL)

### Harnesses
CONTACTOR_6_to_8: CONTACTOR_6_CONTROL, CONTACTOR_7_CONTROL, CONTACTOR_8_CONTROL, CONTACTOR_6_FEEDBACK, CONTACTOR_7_FEEDBACK, CONTACTOR_8_FEEDBACK
ISONOC_CONTROL: 0, 1, 2, 3, 4, 5
ISO_GPIO: IN_0, IN_1, IN_2, IN_3, OUT_3, OUT_0, OUT_1, OUT_2

### Nets
+3.3V_0: JP1.2 JP1.4 JP2.2 JP2.4
GND_0: JP1.1 JP1.3 JP2.1 JP2.3  [project net GND]
ADC_MCU_0_CH_0: JP1.7
ADC_MCU_0_CH_1: JP1.8
ADC_MCU_0_CH_2: JP1.5
ADC_MCU_0_CH_3: JP1.6
ADC_MCU_0_CH_4: JP1.10
CONTACTOR_6_CONTROL: JP2.17 ; port CONTACTOR_6_to_8.CONTACTOR_6_CONTROL
CONTACTOR_6_FEEDBACK: JP2.18 ; port CONTACTOR_6_to_8.CONTACTOR_6_FEEDBACK
CONTACTOR_7_CONTROL: JP2.15 ; port CONTACTOR_6_to_8.CONTACTOR_7_CONTROL
CONTACTOR_7_FEEDBACK: JP2.16 ; port CONTACTOR_6_to_8.CONTACTOR_7_FEEDBACK
CONTACTOR_8_CONTROL: JP1.9 ; port CONTACTOR_6_to_8.CONTACTOR_8_CONTROL
CONTACTOR_8_FEEDBACK: JP1.12 ; port CONTACTOR_6_to_8.CONTACTOR_8_FEEDBACK
ISO_GPIO_MCU_0_IN_0: JP1.21 ; port ISO_GPIO_MCU_0.IN_0
ISO_GPIO_MCU_0_IN_1: JP1.24 ; port ISO_GPIO_MCU_0.IN_1
ISO_GPIO_MCU_0_IN_2: JP2.14 ; port ISO_GPIO_MCU_0.IN_2
ISO_GPIO_MCU_0_IN_3: JP2.9 ; port ISO_GPIO_MCU_0.IN_3
ISO_GPIO_MCU_0_OUT_0: JP2.10 ; port ISO_GPIO_MCU_0.OUT_0
ISO_GPIO_MCU_0_OUT_1: JP2.13 ; port ISO_GPIO_MCU_0.OUT_1
ISO_GPIO_MCU_0_OUT_2: JP2.12 ; port ISO_GPIO_MCU_0.OUT_2
ISO_GPIO_MCU_0_OUT_3: JP2.11 ; port ISO_GPIO_MCU_0.OUT_3
ISONOC_0_CONTROL: JP1.15 ; port ISONOC_CONTROL.0
ISONOC_1_CONTROL: JP1.18 ; port ISONOC_CONTROL.1
ISONOC_2_CONTROL: JP1.17 ; port ISONOC_CONTROL.2
ISONOC_3_CONTROL: JP1.20 ; port ISONOC_CONTROL.3
ISONOC_4_CONTROL: JP1.19 ; port ISONOC_CONTROL.4
ISONOC_5_CONTROL: JP1.22 ; port ISONOC_CONTROL.5

Not connected (* = marked no-connect by the designer): JP1 11 13 14 16 23*; JP2 5 6 7* 8 19 20 21 22 23* 24

### Buses and harness runs
bus ADC_MCU_0_CH_[0..4] = port ADC_MCU_0_CH_[0..4]

### Notes on the sheet
- Fraunhofer IISB
- Schottkystr. 10
- developed by:
- 91058 Erlangen
- Germany
- Author
- Project
- License
- Description
- File
- Version
- Release Date
- Sheet
- www.foxbms.org
- www.iisb.fraunhofer.de
- foxBMS Team
- /

### Library data of the parts
JP1 JP2 = CMP-1023-00145-1: Low Profile Socket Strips, Through-hole, Vertical, -55 to 105 degC, 2.54 mm Pitch, 24-Pin, Female, RoHS; Manufacturer: Samtec; Pitch: 2.54 mm; System: Connector; DatasheetVersion: F-214; ComponentLink3Description: Package Specification; Orientation: Vertical; ComponentLink3URL: http://www.samtec.com/documents/webfiles/cpdf/SLW-1XX-01-X-X-MKT.pdf; ComponentLink1URL: http://www.samtec.com; Temperature Range: -55 to 105 degC; PackageReference: SLW-112-01-X-D; PartNumber: SLW-112-01-T-D; ComponentLink1Description: Manufacturer URL; PackageDescription: Low Profile Socket Strip; Mounting Technology: Through-hole; ComponentLink2Description: Datasheet; RoHS: True; ComponentLink2URL: http://www.samtec.com/documents/webfiles/pdf/SLW.PDF; PackageVersion: X, 9/1987; Part Number: SLW-112-01-T-D

## Sheet interlock_circuit.SchDoc: foxBMS BMS-Master
size A3; DocumentNumber: 15; SheetNumber: 15; SheetTotal: 24; Author: Fraunhofer IISB foxBMS Team; REL-DATE: 2017-05-16; VERSION: 1.0.2; SheetDescription: Interlock Circuit
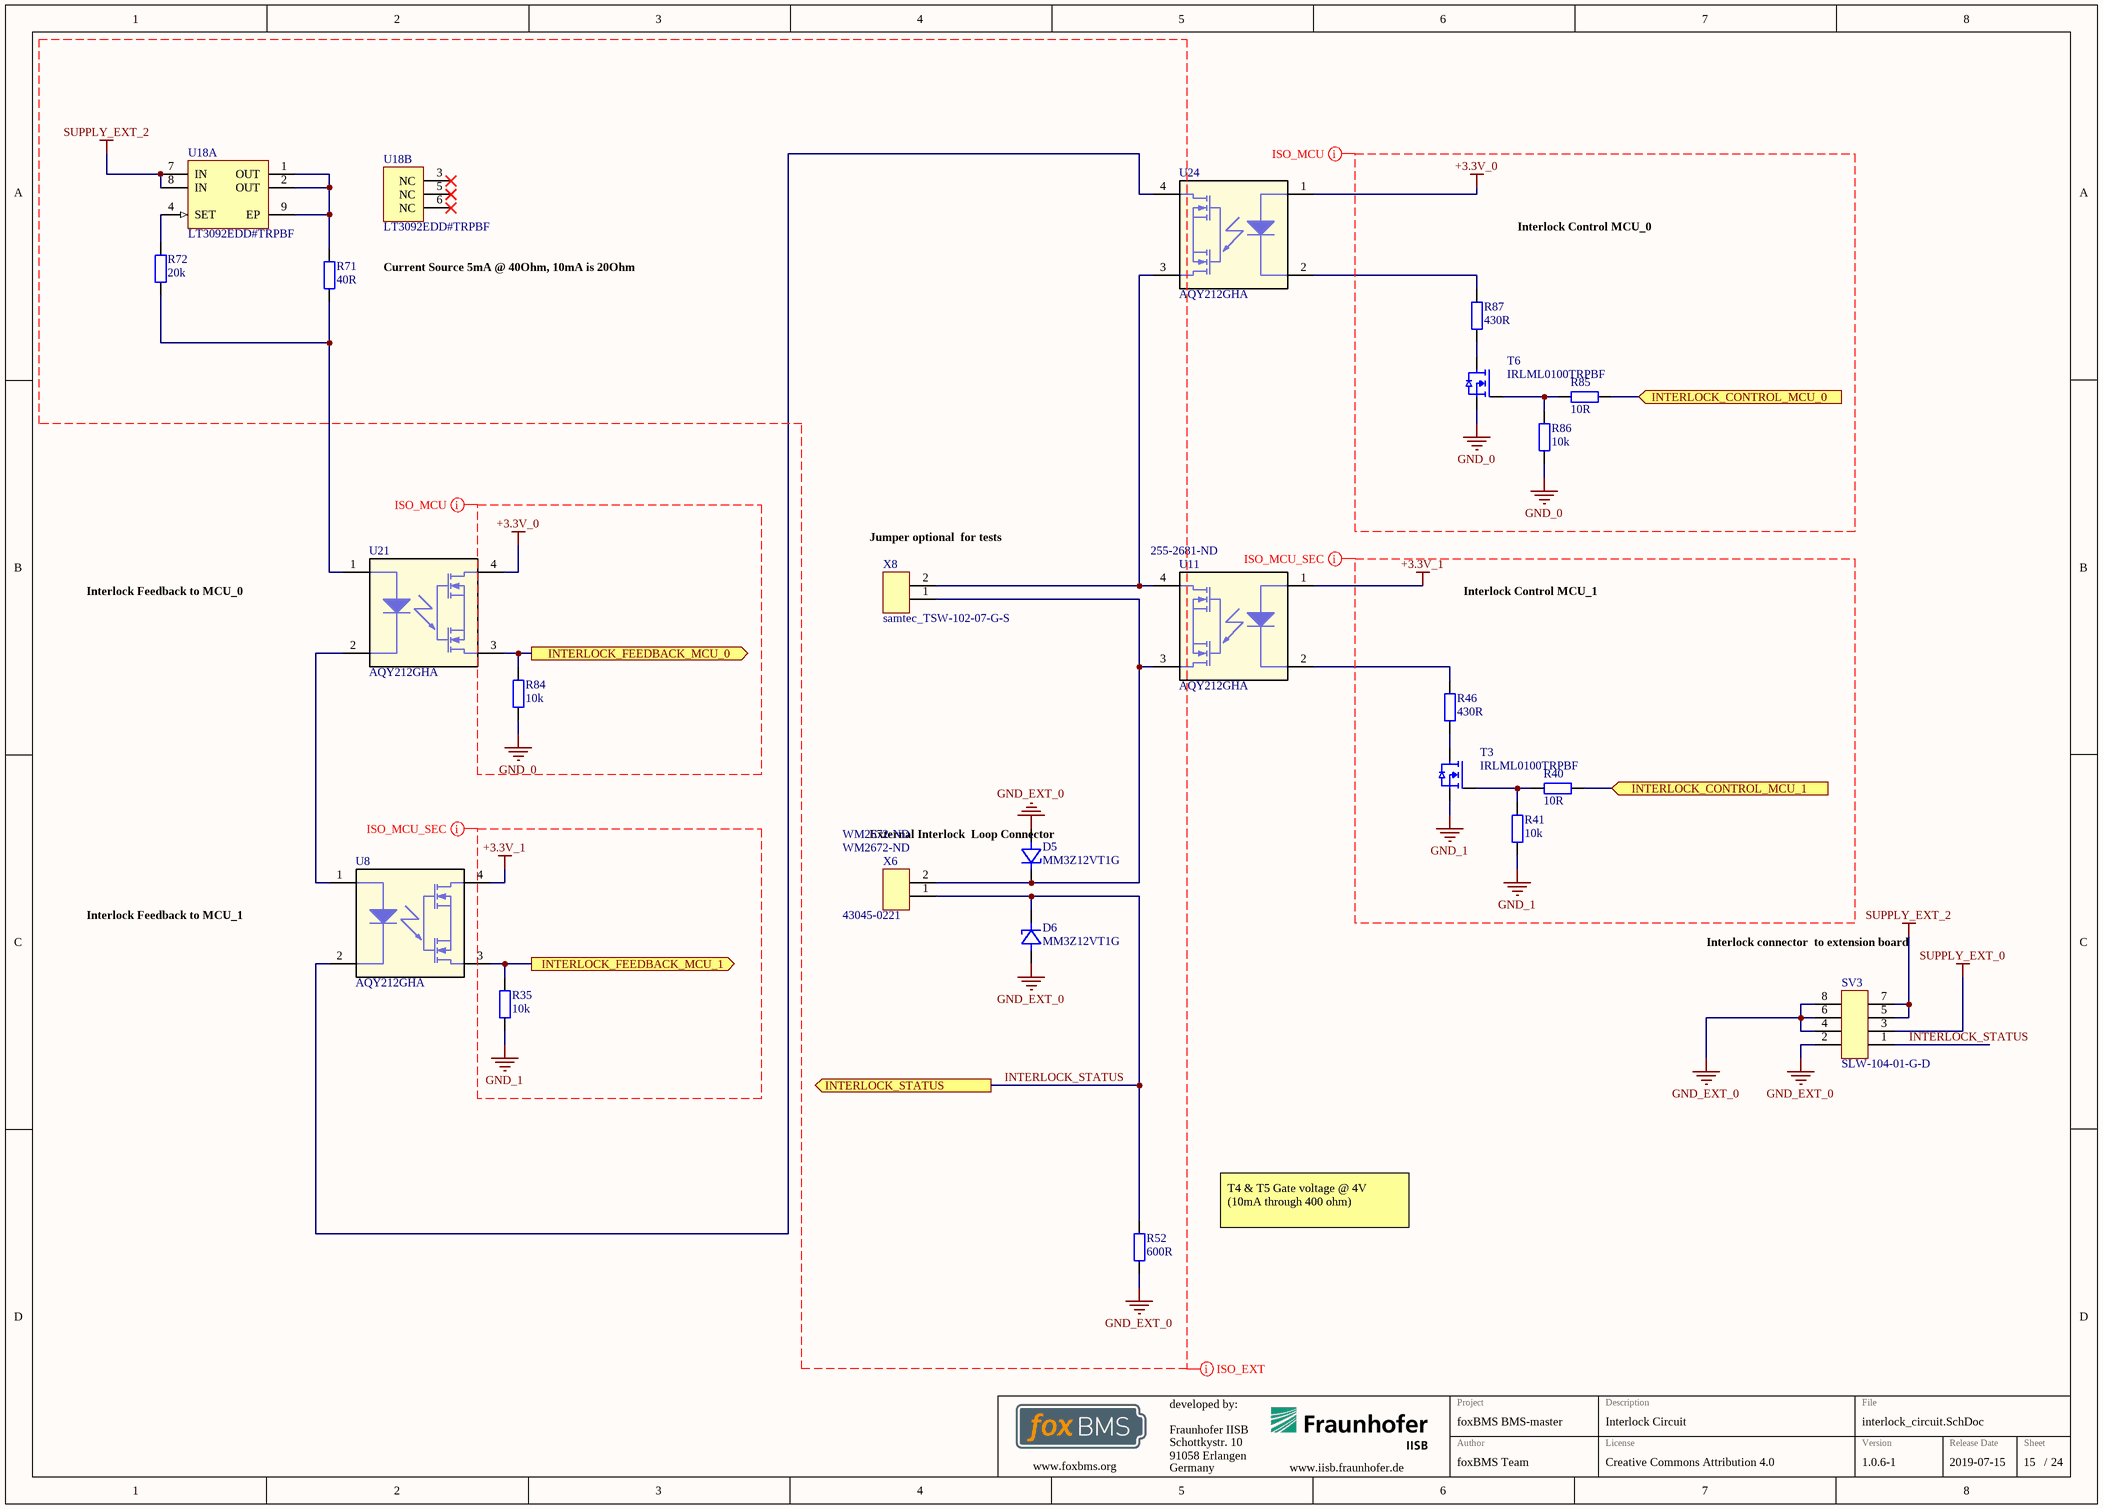
[diagram p17: interlock_circuit.SchDoc]

### Parts
(Parts that share a designator on the sheet are numbered #1, #2 ... from top to bottom, then left to right.)
D5#1  MM3Z12VT1G  [SODFL250X110-2N]
D6#1  MM3Z12VT1G  [SODFL250X110-2N]
R35#2  10k  [0603R]
R40  10R  [0603R]
R41#2  10k  [0603R]
R46  430R  [0603R]
R52#1  600R  [0805R]
R71  40R  [0805R]
R72#2  20k  [0805R]
R84  10k  [0603R]
R85  10R  [0603R]
R86#2  10k  [0603R]
R87  430R  [0603R]
SV3  SLW-104-01-G-D  [SLW_104_01_G_D]
T3  IRLML0100TRPBF  [SOT95P237X110-3N]
T6#2  IRLML0100TRPBF  [SOT95P237X110-3N]
U8  AQY212GHA  [PAN_AQY21-SO4]
U11#2  AQY212GHA  Supplier Part Number 1: 255-2681-ND  [PAN_AQY21-SO4]
U18  LT3092EDD#TRPBF  [LT-DD-8_V]  (parts A,B of 2)
U21  AQY212GHA  [PAN_AQY21-SO4]
U24  AQY212GHA  [PAN_AQY21-SO4]
X6  43045-0221  Supplier Part Number 1: WM2672-ND  [43045-0221]
X8  samtec_TSW-102-07-G-S  [Pinheader_2.54_2]

### Ports
INTERLOCK_CONTROL_MCU_0 (in), INTERLOCK_CONTROL_MCU_1 (in), INTERLOCK_FEEDBACK_MCU_0 (out), INTERLOCK_FEEDBACK_MCU_1 (out), INTERLOCK_STATUS (out)

### Nets
+3.3V_0: U8.4 U11#2.1 U21.4 U24.1  [also labelled +3.3V_1]
GND_0: D5#1.2(A) D6#1.2(A) R35#2.1 R41#2.2 R52#1.1 R84.1 R86#2.2 SV3.2 SV3.4 SV3.6 SV3.8 T3.S T6#2.S  [also labelled GND_1, GND_EXT_0]  [project net GND]
SUPPLY_EXT_0: SV3.3  [project net +9-30V_IN]
SUPPLY_EXT_2: SV3.5 SV3.7 U18.7(IN) U18.8(IN)  [project net SUPPLY_ext]
INTERLOCK_CONTROL_MCU_0: R85.2 ; port INTERLOCK_CONTROL_MCU_0
INTERLOCK_CONTROL_MCU_1: R40.2 ; port INTERLOCK_CONTROL_MCU_1
INTERLOCK_FEEDBACK_MCU_0: R84.2 U21.3 ; port INTERLOCK_FEEDBACK_MCU_0
INTERLOCK_FEEDBACK_MCU_1: R35#2.2 U8.3 ; port INTERLOCK_FEEDBACK_MCU_1
INTERLOCK_STATUS: D6#1.1(K) R52#1.2 SV3.1 X6.1 ; port INTERLOCK_STATUS
NetD5#1_1: D5#1.1(K) U11#2.3 X6.2 X8.1
NetR40_1: R40.1 R41#2.1 T3.G
NetR46_1: R46.1 T3.D
NetR46_2: R46.2 U11#2.2
NetR71_1: R71.1 R72#2.1 U21.1
NetR71_2: R71.2 U18.1(OUT) U18.2(OUT) U18.9(EP)
NetR72#2_2: R72#2.2 U18.4(SET)
NetR85_1: R85.1 R86#2.1 T6#2.G
NetR87_1: R87.1 T6#2.D
NetR87_2: R87.2 U24.2
NetU8_1: U8.1 U21.2
NetU8_2: U8.2 U24.4
NetU11#2_4: U11#2.4 U24.3 X8.2

Not connected (* = marked no-connect by the designer): U18 3(NC)* 5(NC)* 6(NC)*

### Layout directives
net class ISO_MCU: +3.3V_0, GND_0
net class ISO_MCU_SEC: +3.3V_1, GND_1
net class ISO_EXT: GND_EXT_0, INTERLOCK_STATUS, SUPPLY_EXT_2

### Notes on the sheet
- Interlock Control MCU_0
- Current Source 5mA @ 40Ohm, 10mA is 20Ohm
- (near X8) Jumper optional
  for tests
- Interlock Feedback to MCU_0
- Interlock Control MCU_1
- (near D5#1) External Interlock
  Loop Connector
- Interlock Feedback to MCU_1
- Interlock connector
  to extension board
- T4 & T5 Gate voltage @ 4V (10mA through 400 ohm)
- Fraunhofer IISB
- Schottkystr. 10
- developed by:
- 91058 Erlangen
- Germany
- Author
- Project
- License
- Description
- File
- Version
- Release Date
- Sheet
- www.foxbms.org
- www.iisb.fraunhofer.de
- foxBMS Team
- /

### Library data of the parts
D5#1 D6#1 = MM3Z12VT1G: Zener Diode; Manufacturer: ON Semiconductor; Breakdown Voltage: 12V; PnP Package: SOD323; Automotive Qualified: True; Part Number: MM3Z12VT1G; Part Name: MM3Z12VT1G; Operating Temperature: *; Continuous Forward Current: *; ComponentLink1Description: Datasheet; ComponentLink1URL: http://www.farnell.com/datasheets/1876691.pdf; Supplier 1: Farnell; Supplier Part Number 1: 1431191; Supplier 2: Digikey; Supplier Part Number 2: MM3Z12VT1GOSCT-ND; Supplier 3: Mouser; Supplier Part Number 3: 863-MM3Z12VT1G
R35#2 R41#2 R84 R86#2 = gen_R_10k_0603: as R1#1 on sheet mcu1_secondary; Part Number: gen_R_10k_0603; Operating Temperature: -55°C - +155°C; Resistance: 10k; Series: E24, E96; PnP Value: 10k; Supplier 1: Farnell; Supplier Part Number 1: 2073349
R40 R85 = gen_R_10R_0603: SMD Resistor 10R 0603; Tolerance: 1%; Power: 0.1W; Case EIA: 0603; Case Metric: 1608; Maximum Working Voltage: 75V; PnP Package: R_0603; Automotive Qualified: False; Part Number: gen_R_10R_0603; Operating Temperature: -55°C - +155°C; Resistance: 10R; Series: E24, E96; PnP Value: 10R; Supplier 1: Farnell; Supplier Part Number 1: 2073361
R46 R87 = gen_R_430R_0603: SMD Resistor 430R 0603; Tolerance: 1%; Power: 0.1W; Case EIA: 0603; Case Metric: 1608; Maximum Working Voltage: 75V; PnP Package: R_0603; Automotive Qualified: False; Part Number: gen_R_430R_0603; Operating Temperature: -55°C - +155°C; Resistance: 430R; Series: E24; PnP Value: 430R; Supplier 1: Farnell; Supplier Part Number 1: 2074259
R52#1 = gen_R_330R_0603: SMD Resistor 330R 0603; Part Number: gen_R_600R_0805; Power: 0.1W; Case EIA: 0805; Case Metric: 2012; Maximum Working Voltage: 75V; PnP Package: R_0603; Automotive Qualified: False; Operating Temperature: -55°C - +155°C; Resistance: 600R; Series: E24; PnP Value: 600R
R71 R72#2 = gen_R_120R_0603: SMD Resistor 120R 0603; Tolerance: 1%; Power: 0.1W; Case EIA: 0805; Case Metric: 2012; Maximum Working Voltage: 75V; PnP Package: R_0603; Automotive Qualified: False; Part Number: gen_R_120R_0603; Operating Temperature: -55°C - +155°C; Series: E24; PnP Value: 120R; Supplier 1: Farnell; Supplier Part Number 1: 2073369
  R71: Resistance: 40R
  R72#2: Resistance: 20k
SV3 = samtec_SLW-104-01-G-D: Board-To-Board Connector, Dual, 2.54 mm, 8 Contacts, Receptacle, SLW Series, Through Hole, 2 Rows; Manufacturer: Samtec; Circuits: 8; Rated Voltage: 406VAC Voltage rating; Rated Current: 5.2A; Automotive Qualified: False; Part Number: SLW-104-01-G-D; Part Name: SLW-104-01-G-D; Operating Temperature: -55°C - +125°C; ComponentLink1Description: Datasheet; ComponentLink1URL: http://www.farnell.com/datasheets/1927699.pdf; Supplier 1: Farnell; Supplier Part Number 1: 1668094; System: Connector
T3 T6#2 = IRLML0100TRPBF: MOSFET-Transistor, n-Kanal, 1.6 A, 100 V, 0.178 ohm, 10 V, 2.5 V; Manufacturer: Infineon; Maximum Drain-Source Voltage: 100V; Maximum Continous Drain Current (25°C): 1.6A; R_DS(on): 190m; Total Gate Charge: 2.5nC; Automotive Qualified: False; Part Number: IRLML0100TRPBF; Part Name: NMOS; Operating Temperature: -55°C - +150°C; ComponentLink1Description: Datasheet URL; ComponentLink1URL: http://www.farnell.com/datasheets/491501.pdf; Supplier 1: Farnell; Supplier Part Number 1: 1783928
U8 U11#2 U21 U24 = AQY212GHA: PhotoMOS GU 1 Form A, 60 V Load Voltage, 1.1 A Continuous Load Current, -40 to 85 degC, 4-Pin DIP(SMT), Tube, RoHS; Manufacturer: Panasonic; Pb-Free: True; Load Voltage: 60 V; Continuous Load Current: 1.1 A; On Resistance (Typ): 0.34 Ohm; ComponentLink1Description: Manufacturer URL; ComponentLink2Description: Datasheet; ComponentLink3Description: Package Specification; Series: PhotoMOS GU 1 Form A; ComponentLink3URL: http://www3.panasonic.biz/ac/e_download/control/relay/photomos/catalog/semi_eng_dimensions.pdf?f_cd=401560; DatasheetVersion: 201404-T; ComponentLink1URL: http://www3.panasonic.biz/ac/ae/index.jsp; Mounting Technology: Surface Mount; Packing: Tube; PackageVersion: ASCTB67E, 04/2014; PartNumber: AQY212GHA; PackageDescription: 4-Pin Surface Mount Terminal Package, Body 4.78 x 6.4 mm, Pitch 2.54mm; ComponentLink2URL: http://www3.panasonic.biz/ac/e_download/control/relay/photomos/catalog/semi_eng_gu1a_aqy21_g.pdf; RoHS: True; PackageReference: DIP4(SMT); Part Number: AQY212GHA
  U11#2: Supplier 1: Digi-Key
U18 = CMP-0472-00014-1: 200 mA Two-Terminal Programmable Current Source, 0.3 mA Isupply, 8-pin SON (DD-8), -40 to 125 degC, Pb-Free, Tape and Reel; Manufacturer: Linear Technology; Extended Temp: E, I, MP; Initial Accuracy(%): 1; Output Current Range: 0.5 mA to 200 mA; Vin Max(V): 40; Vin Min(V): 1.2; Isupply(mA): 0.3; DatasheetVersion: Rev. B; PackageDescription: 8-Pin Plastic DFN, Body 3 x 3 mm, Pitch 0.5 mm; ComponentLink2Description: Datasheet; ComponentLink1URL: http://www.linear.com/; Code_JEDEC: MO-229; ComponentLink2URL: http://cds.linear.com/docs/en/datasheet/3092fb.pdf; Mounting Technology: Surface Mount; ComponentLink1Description: Manufacturer URL; ComponentLink3Description: Package Specification; Packing: Tape and Reel; PackageReference: DD-8; ComponentLink3URL: http://cds.linear.com/docs/en/packaging/DFN_8_05-08-1698.pdf; PartNumber: LT3092EDD#TRPBF; RoHS: TRUE; PackageVersion: Jun-10; PartId: 1
X6 = molex_microfit_3_01x2_THT: Micro-Fit 3.0 Right Angle Header, 3.00mm Pitch, Dual Row, 2 Circuits, with Snap-in Plastic Peg PCB Lock, Tin, Glow Wire Capable, Black, 43045-0200; Manufacturer: Molex; Circuits: 2; Rated Voltage: 600V; Rated Current: 8.5A; Automotive Qualified: False; Part Number: molex_microfit_3_01x2_THT; Part Name: MicroFit; Operating Temperature: -40°C - +105°C; Supplier 1: Digi-Key; Supplier 2: Digi-Key; Supplier Part Number 2: WM2672-ND
X8 = samtec_TSW-102-07-G-S: as X501 on sheet mcu1_secondary; Part Number: samtec_TSW-102-07-G-S; Part Name: TSW-102-07-G-S; Operating Temperature: -55°C - +125°C; ComponentLink1Description: Datasheet; ComponentLink1URL: http://www.farnell.com/datasheets/1796313.pdf; Supplier 1: Farnell; Supplier Part Number 1: 2505044